# Altium project H7_PCB.PrjPcb (part 1 of 2)
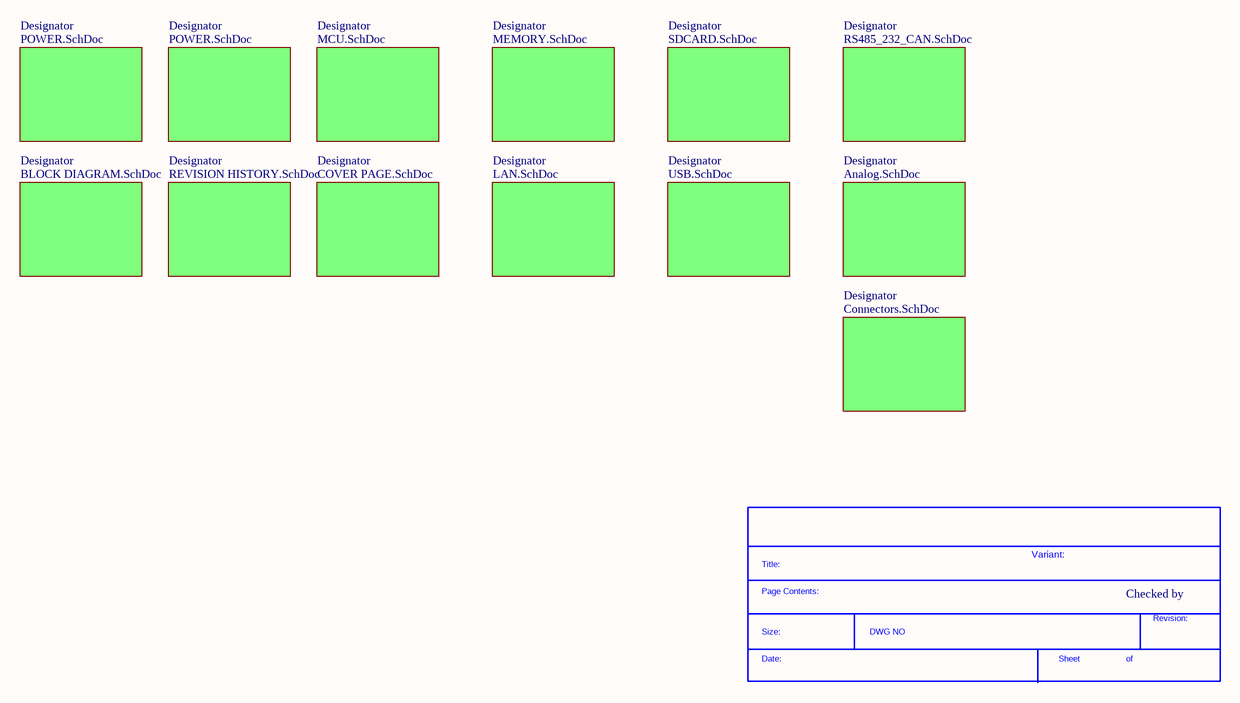
[diagram p0: PROJECT.SchDoc]
VersionRevision: V1I1; Project: H743; NotFitted: NF; MAINDESIGNER: Hamid Fijani; Company: ARKASSH; ClientWebsite: www.ArkaSSH.ir; ClientContactName: Hamid Fijani; ClientContactEmail: FijaniHamid@gmail.com; ClientCompanyName: ARKASSH
13 sheets, 297 parts. Net scope: flat (ports and power ports of the same name join across sheets).
Board file: PCB1.PcbDoc
Sheets:
  PROJECT.SchDoc
    Designator = MCU.SchDoc
    Designator = POWER.SchDoc
    Designator = POWER.SchDoc
    Designator = BLOCK DIAGRAM.SchDoc
    Designator = REVISION HISTORY.SchDoc
    Designator = MEMORY.SchDoc
    Designator = COVER PAGE.SchDoc
    Designator = LAN.SchDoc
    Designator = SDCARD.SchDoc
    Designator = USB.SchDoc
    Designator = RS485_232_CAN.SchDoc
    Designator = Analog.SchDoc
    Designator = Connectors.SchDoc

## Sheet PROJECT.SchDoc
size A4; SheetNumber: 1; SheetTotal: 13

### Parts
(Parts that share a designator on the sheet are numbered #1, #2 ... from top to bottom, then left to right.)
*?#1  SDTitleBlock  (value not drawn)  (graphical)

### Sub-sheets
Designator = MCU.SchDoc: no entries
Designator = POWER.SchDoc: no entries
Designator = POWER.SchDoc: no entries
Designator = BLOCK DIAGRAM.SchDoc: no entries
Designator = REVISION HISTORY.SchDoc: no entries
Designator = MEMORY.SchDoc: no entries
Designator = COVER PAGE.SchDoc: no entries
Designator = LAN.SchDoc: no entries
Designator = SDCARD.SchDoc: no entries
Designator = USB.SchDoc: no entries
Designator = RS485_232_CAN.SchDoc: no entries
Designator = Analog.SchDoc: no entries
Designator = Connectors.SchDoc: no entries

### Notes on the sheet
- Variant:
- Checked by
- (in symbol SDTitleBlock) Title:; Page Contents:; Revision:; Size:; DWG NO; Date:; Sheet; of

## Sheet MCU.SchDoc
size A3; SheetNumber: 4; SheetTotal: 13
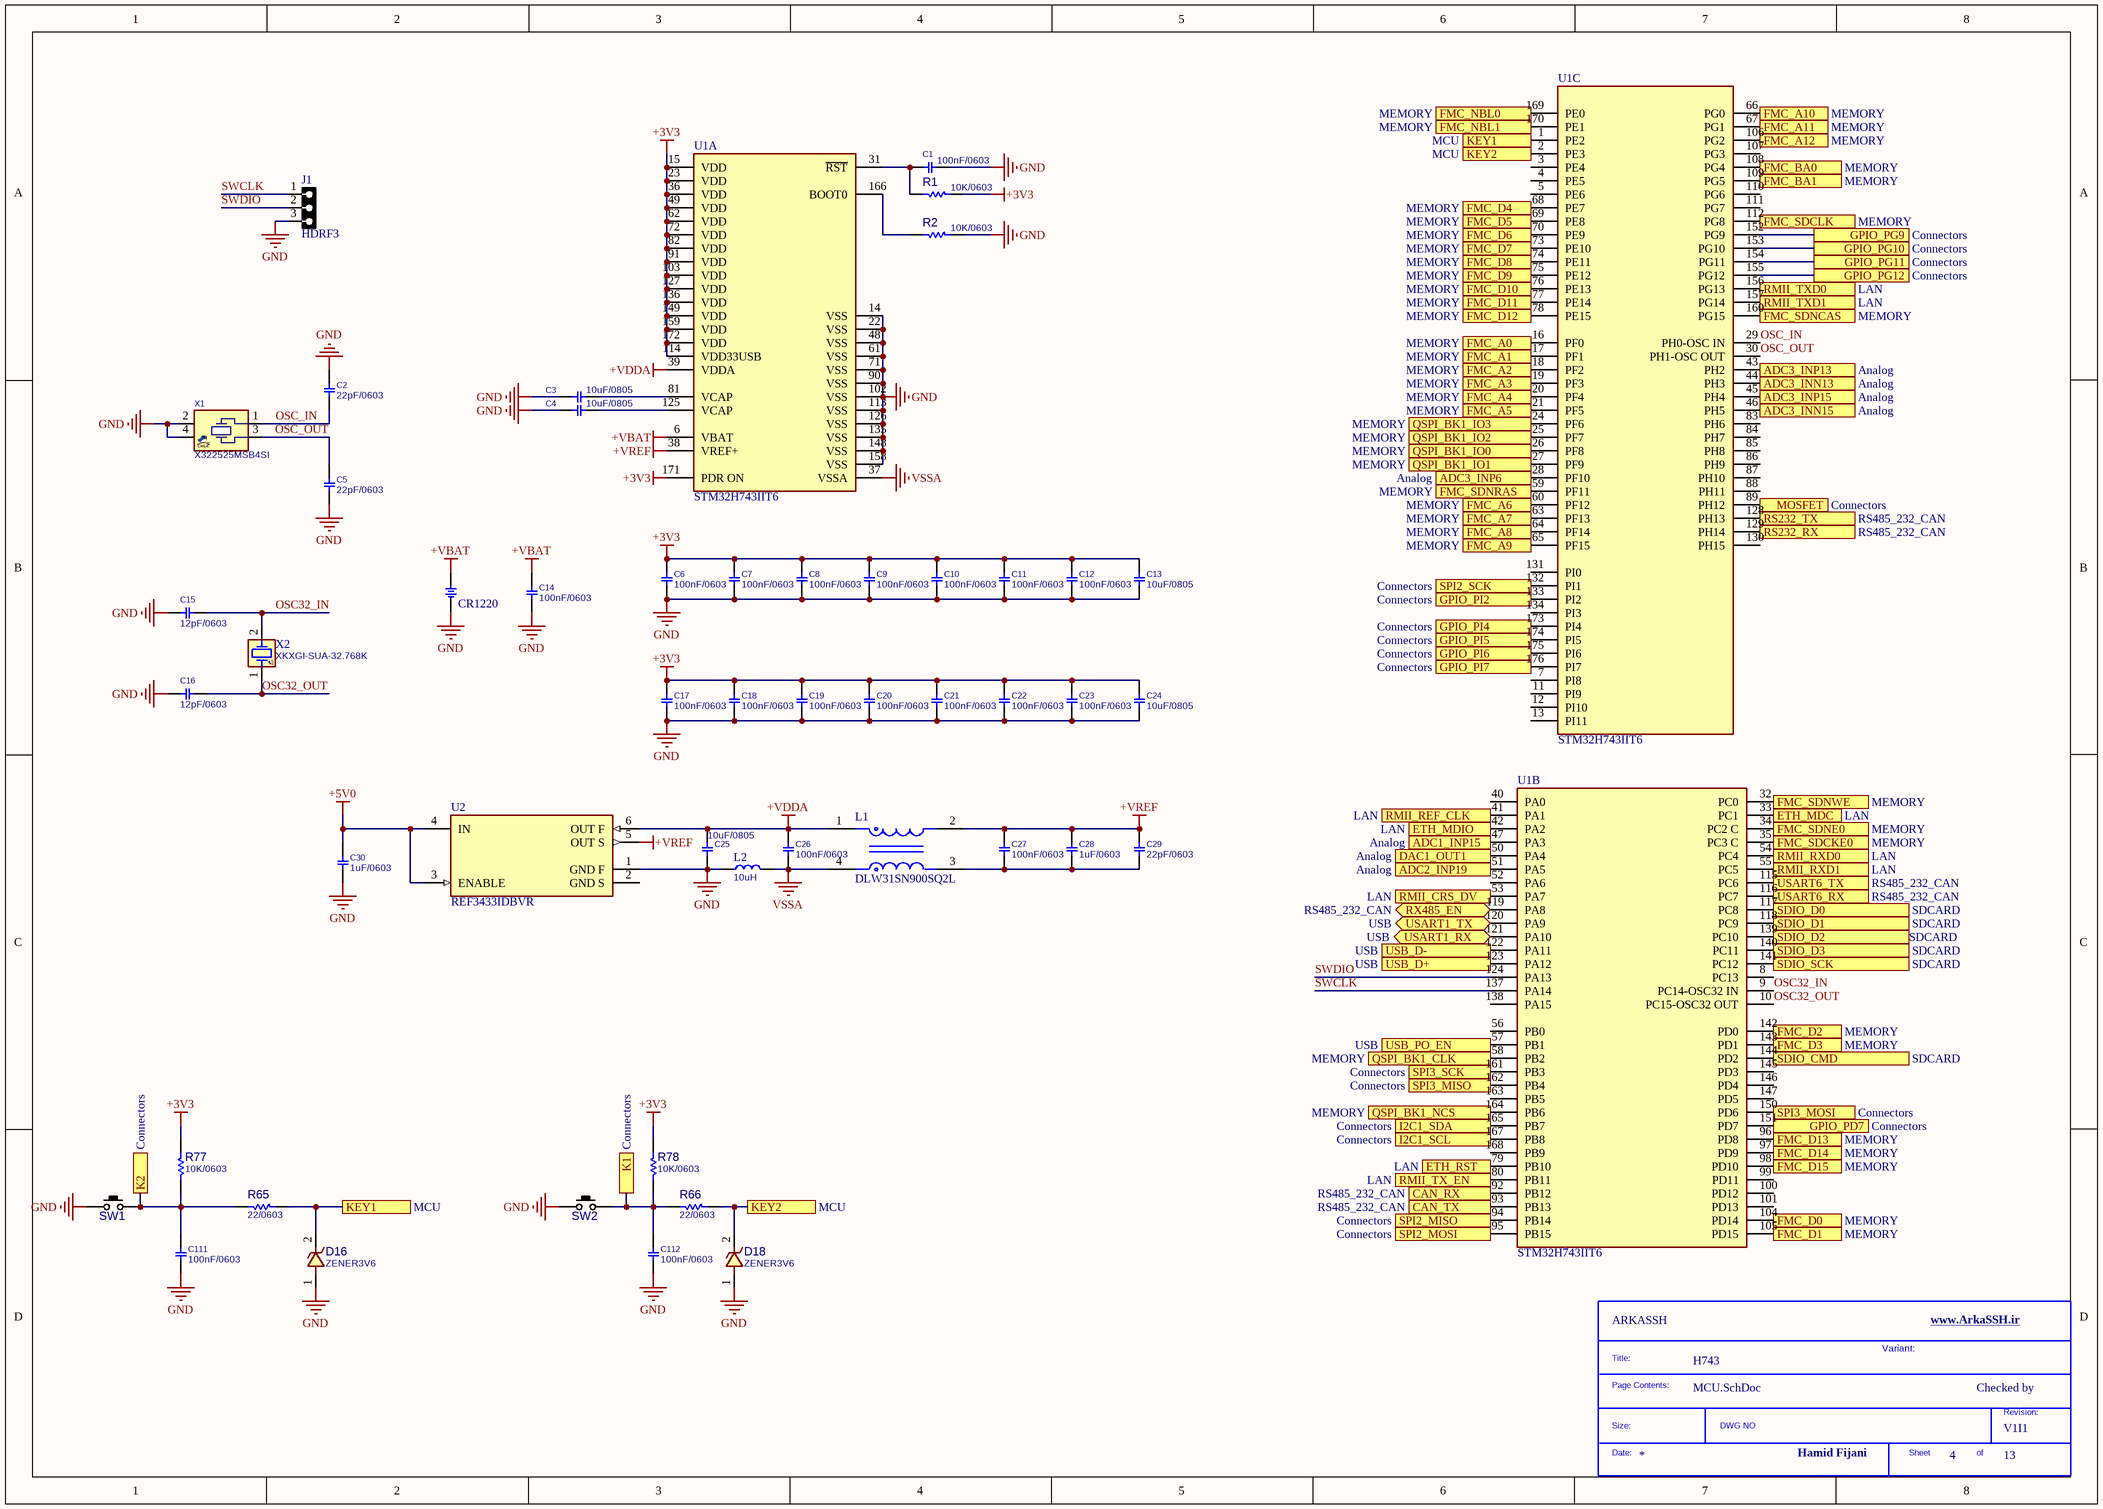
[diagram p1: MCU.SchDoc]

### Parts
(Parts that share a designator on the sheet are numbered #1, #2 ... from top to bottom, then left to right.)
?#1  (no value)  (graphical)
BT1  CR1220  [BTH1220]
C1  100nF/0603  [C0603]
C2  22pF/0603  [C0603]
C3  10uF/0805  [C0805]
C4  10uF/0805  [C0805]
C5  22pF/0603  [C0603]
C6  100nF/0603  [C0603]
C7  100nF/0603  [C0603]
C8  100nF/0603  [C0603]
C9  100nF/0603  [C0603]
C10  100nF/0603  [C0603]
C11  100nF/0603  [C0603]
C12  100nF/0603  [C0603]
C13  10uF/0805  [C0805]
C14  100nF/0603  [C0603]
C15  12pF/0603  [C0603]
C16  12pF/0603  [C0603]
C17  100nF/0603  [C0603]
C18  100nF/0603  [C0603]
C19  100nF/0603  [C0603]
C20  100nF/0603  [C0603]
C21  100nF/0603  [C0603]
C22  100nF/0603  [C0603]
C23  100nF/0603  [C0603]
C24  10uF/0805  [C0805]
C25  10uF/0805  [C0805]
C26  100nF/0603  [C0603]
C27  100nF/0603  [C0603]
C28  1uF/0603  [C0603]
C29  22pF/0603  [C0603]
C30  1uF/0603  [C0603]
C111  100nF/0603  [C0603]
C112  100nF/0603  [C0603]
D16  ZENER3V6  [D_SOD123W]
D18  ZENER3V6  [D_SOD123W]
J1  HDRF3  [HDR_F_1X3]
L1  DLW31SN900SQ2L  [FP-DLW31S-MFG]
L2  10uH  [L0805]
R1  10K/0603  [R0603]
R2  10K/0603  [R0603]
R65  22/0603  [R0603]
R66  22/0603  [R0603]
R77  10K/0603  [R0603]
R78  10K/0603  [R0603]
SW1  PUSHBUTTON  [SWPBS_SPST_6X3X5]  (value not drawn)
SW2  PUSHBUTTON  [SWPBS_SPST_6X3X5]  (value not drawn)
U1  STM32H743IIT6  [FP-LQFP176-1T-IPC_C]  (parts A,B,C of 3)
U2  REF3433IDBVR  [FP-DBV0006A-MFG]
X1  X322525MSB4SI  [XTL_4_3225]
X2  XKXGI-SUA-32.768K  [XTL_2_3215]

### Ports
ADC1_INP15 (see Analog), ADC2_INP19 (see Analog), ADC3_INN13 (see Analog), ADC3_INN15 (see Analog), ADC3_INP6 (see Analog), ADC3_INP13 (see Analog), ADC3_INP15 (see Analog), CAN_RX (see RS485_232_CAN), CAN_TX (see RS485_232_CAN), DAC1_OUT1 (see Analog), ETH_MDC (see LAN), ETH_MDIO (see LAN), ETH_RST (see LAN), FMC_A0 (see MEMORY), FMC_A1 (see MEMORY), FMC_A2 (see MEMORY), FMC_A3 (see MEMORY), FMC_A4 (see MEMORY), FMC_A5 (see MEMORY), FMC_A6 (see MEMORY), FMC_A7 (see MEMORY), FMC_A8 (see MEMORY), FMC_A9 (see MEMORY), FMC_A10 (see MEMORY), FMC_A11 (see MEMORY), FMC_A12 (see MEMORY), FMC_BA0 (see MEMORY), FMC_BA1 (see MEMORY), FMC_D0 (see MEMORY), FMC_D1 (see MEMORY), FMC_D2 (see MEMORY), FMC_D3 (see MEMORY), FMC_D4 (see MEMORY), FMC_D5 (see MEMORY), FMC_D6 (see MEMORY), FMC_D7 (see MEMORY), FMC_D8 (see MEMORY), FMC_D9 (see MEMORY), FMC_D10 (see MEMORY), FMC_D11 (see MEMORY), FMC_D12 (see MEMORY), FMC_D13 (see MEMORY), FMC_D14 (see MEMORY), FMC_D15 (see MEMORY), FMC_NBL0 (see MEMORY), FMC_NBL1 (see MEMORY), FMC_SDCKE0 (see MEMORY), FMC_SDCLK (see MEMORY), FMC_SDNCAS (see MEMORY), FMC_SDNE0 (see MEMORY), FMC_SDNRAS (see MEMORY), FMC_SDNWE (see MEMORY), GPIO_PD7 (see Connectors), GPIO_PG9 (see Connectors), GPIO_PG10 (see Connectors), GPIO_PG11 (see Connectors), GPIO_PG12 (see Connectors), GPIO_PI2 (see Connectors), GPIO_PI4 (see Connectors), GPIO_PI5 (see Connectors), GPIO_PI6 (see Connectors), GPIO_PI7 (see Connectors), I2C1_SCL (see Connectors), I2C1_SDA (see Connectors), K1 (see Connectors), K2 (see Connectors), KEY1 (see MCU), KEY2 (see MCU), MOSFET (see Connectors), QSPI_BK1_CLK (see MEMORY), QSPI_BK1_IO0 (see MEMORY), QSPI_BK1_IO1 (see MEMORY), QSPI_BK1_IO2 (see MEMORY), QSPI_BK1_IO3 (see MEMORY), QSPI_BK1_NCS (see MEMORY), RMII_CRS_DV (see LAN), RMII_REF_CLK (see LAN), RMII_RXD0 (see LAN), RMII_RXD1 (see LAN), RMII_TX_EN (see LAN), RMII_TXD0 (see LAN), RMII_TXD1 (see LAN), RS232_RX (see RS485_232_CAN), RS232_TX (see RS485_232_CAN), RX485_EN (bidir, see RS485_232_CAN), SDIO_CMD (see SDCARD), SDIO_D0 (see SDCARD), SDIO_D1 (see SDCARD), SDIO_D2 (see SDCARD), SDIO_D3 (see SDCARD), SDIO_SCK (see SDCARD), SPI2_MISO (see Connectors), SPI2_MOSI (see Connectors), SPI2_SCK (see Connectors), SPI3_MISO (see Connectors), SPI3_MOSI (see Connectors), SPI3_SCK (see Connectors), USART1_RX (bidir, see USB), USART1_TX (bidir, see USB), USART6_RX (see RS485_232_CAN), USART6_TX (see RS485_232_CAN), USB_D+ (see USB), USB_D- (see USB), USB_PO_EN (see USB)

### Nets
+3V3: C6.2 C7.2 C8.2 C9.2 C10.2 C11.2 C12.2 C13.2 C17.2 C18.2 C19.2 C20.2 C21.2 C22.2 C23.2 C24.2 R1.2 R77.2 R78.2 U1.15(VDD) U1.23(VDD) U1.36(VDD) U1.49(VDD) U1.62(VDD) U1.72(VDD) U1.82(VDD) U1.91(VDD) U1.103(VDD) U1.114(VDD33USB) U1.127(VDD) U1.136(VDD) U1.149(VDD) U1.159(VDD) U1.171(PDR_ON) U1.172(VDD)
+5V0: C30.2 U2.3(ENABLE) U2.4(IN)
+VBAT: BT1.1 C14.2 U1.6(VBAT)
+VDDA: C25.2 C26.2 L1.1 U1.39(VDDA) U2.6(OUT_F)
+VREF: C27.2 C28.2 C29.2 L1.2 U1.38(VREF+) U2.5(OUT_S)
GND: BT1.2 C1.1 C2.2 C3.1 C4.1 C5.1 C6.1 C7.1 C8.1 C9.1 C10.1 C11.1 C12.1 C13.1 C14.1 C15.2 C16.2 C17.1 C18.1 C19.1 C20.1 C21.1 C22.1 C23.1 C24.1 C25.1 C30.1 C111.1 C112.1 D16.1 D18.1 J1.3 L2.1 R2.2 SW1.1(P1) SW2.1(P1) U1.14(VSS) U1.22(VSS) U1.48(VSS) U1.61(VSS) U1.71(VSS) U1.90(VSS) U1.102(VSS) U1.113(VSS) U1.126(VSS) U1.135(VSS) U1.148(VSS) U1.158(VSS) U2.1(GND_F) X1.2 X1.4
VSSA: C26.1 L1.4 L2.2 U1.37(VSSA)
DUSB1_N: U1.122(PA11) ; port USB_D-
DUSB1_P: U1.123(PA12) ; port USB_D+
OSC32_IN: C15.1 U1.9(PC14-OSC32_IN) X2.2(OSC2)
OSC32_OUT: C16.1 U1.10(PC15-OSC32_OUT) X2.1(OSC1)
OSC_IN: C2.1 U1.29(PH0-OSC_IN) X1.1
OSC_OUT: C5.2 U1.30(PH1-OSC_OUT) X1.3
RMII_CRS_DV: U1.53(PA7) ; port RMII_CRS_DV
RMII_REF_CLK: U1.41(PA1) ; port RMII_REF_CLK
RMII_RXD0: U1.54(PC4) ; port RMII_RXD0
RMII_RXD1: U1.55(PC5) ; port RMII_RXD1
RMII_TX_EN: U1.80(PB11) ; port RMII_TX_EN
RMII_TXD0: U1.156(PG13) ; port RMII_TXD0
RMII_TXD1: U1.157(PG14) ; port RMII_TXD1
SD_CMD: U1.144(PD2) ; port SDIO_CMD
SD_D0: U1.117(PC8) ; port SDIO_D0
SD_D1: U1.118(PC9) ; port SDIO_D1
SD_D2: U1.139(PC10) ; port SDIO_D2
SD_D3: U1.140(PC11) ; port SDIO_D3
SD_SCK: U1.141(PC12) ; port SDIO_SCK
SWCLK: J1.1 U1.137(PA14)
SWDIO: J1.2 U1.124(PA13)
NetC1_2: C1.2 R1.1 U1.31(~{RST})
NetC3_2: C3.2 U1.81(VCAP)
NetC4_2: C4.2 U1.125(VCAP)
NetC27_1: C27.1 C28.1 C29.1 L1.3
NetC73_1: U1.43(PH2) ; port ADC3_INP13
NetC75_2: U1.44(PH3) ; port ADC3_INN13
NetC77_1: U1.47(PA3) ; port ADC1_INP15
NetC86_1: U1.51(PA5) ; port ADC2_INP19
NetC94_1: U1.45(PH4) ; port ADC3_INP15
NetC98_2: U1.46(PH5) ; port ADC3_INN15
NetC111_2: C111.2 R65.2 R77.1 SW1.2(P3) ; port K2
NetC112_2: C112.2 R66.2 R78.1 SW2.2(P3) ; port K1
NetD16_2: D16.2 R65.1 U1.1(PE2) ; port KEY1
NetD18_2: D18.2 R66.1 U1.2(PE3) ; port KEY2
NetJ9_1: U1.153(PG10) ; port GPIO_PG10
NetJ9_2: U1.151(PD7) ; port GPIO_PD7
NetJ9_3: U1.154(PG11) ; port GPIO_PG11
NetJ9_4: U1.152(PG9) ; port GPIO_PG9
NetJ9_5: U1.155(PG12) ; port GPIO_PG12
NetJ9_7: U1.150(PD6) ; port SPI3_MOSI
NetJ9_9: U1.161(PB3) ; port SPI3_SCK
NetJ9_11: U1.162(PB4) ; port SPI3_MISO
NetJ9_13: U1.173(PI4) ; port GPIO_PI4
NetJ9_15: U1.174(PI5) ; port GPIO_PI5
NetJ9_17: U1.175(PI6) ; port GPIO_PI6
NetJ9_19: U1.176(PI7) ; port GPIO_PI7
NetR2_1: R2.1 U1.166(BOOT0)
NetR8_2: U1.79(PB10) ; port ETH_RST
NetR9_1: U1.42(PA2) ; port ETH_MDIO
NetR27_2: U1.34(PC2_C) ; port FMC_SDNE0
NetR29_1: U1.57(PB1) ; port USB_PO_EN
NetR31_2: U1.121(PA10) ; port USART1_RX
NetR32_2: U1.120(PA9) ; port USART1_TX
NetR34_2: U1.116(PC7) ; port USART6_RX
NetR36_2: U1.119(PA8) ; port RX485_EN
NetR57_1: U1.50(PA4) ; port DAC1_OUT1
NetR69_2: U1.28(PF10) ; port ADC3_INP6
NetR75_2: U1.89(PH12) ; port MOSFET
NetR82_2: U1.167(PB8) ; port I2C1_SCL
NetR83_2: U1.165(PB7) ; port I2C1_SDA
NetR86_1: U1.133(PI2) ; port GPIO_PI2
NetR87_1: U1.94(PB14) ; port SPI2_MISO
NetR88_1: U1.95(PB15) ; port SPI2_MOSI
NetR89_1: U1.132(PI1) ; port SPI2_SCK
NetU1_16: U1.16(PF0) ; port FMC_A0
NetU1_17: U1.17(PF1) ; port FMC_A1
NetU1_18: U1.18(PF2) ; port FMC_A2
NetU1_19: U1.19(PF3) ; port FMC_A3
NetU1_20: U1.20(PF4) ; port FMC_A4
NetU1_21: U1.21(PF5) ; port FMC_A5
NetU1_24: U1.24(PF6) ; port QSPI_BK1_IO3
NetU1_25: U1.25(PF7) ; port QSPI_BK1_IO2
NetU1_26: U1.26(PF8) ; port QSPI_BK1_IO0
NetU1_27: U1.27(PF9) ; port QSPI_BK1_IO1
NetU1_32: U1.32(PC0) ; port FMC_SDNWE
NetU1_33: U1.33(PC1) ; port ETH_MDC
NetU1_35: U1.35(PC3_C) ; port FMC_SDCKE0
NetU1_58: U1.58(PB2) ; port QSPI_BK1_CLK
NetU1_59: U1.59(PF11) ; port FMC_SDNRAS
NetU1_60: U1.60(PF12) ; port FMC_A6
NetU1_63: U1.63(PF13) ; port FMC_A7
NetU1_64: U1.64(PF14) ; port FMC_A8
NetU1_65: U1.65(PF15) ; port FMC_A9
NetU1_66: U1.66(PG0) ; port FMC_A10
NetU1_67: U1.67(PG1) ; port FMC_A11
NetU1_68: U1.68(PE7) ; port FMC_D4
NetU1_69: U1.69(PE8) ; port FMC_D5
NetU1_70: U1.70(PE9) ; port FMC_D6
NetU1_73: U1.73(PE10) ; port FMC_D7
NetU1_74: U1.74(PE11) ; port FMC_D8
NetU1_75: U1.75(PE12) ; port FMC_D9
NetU1_76: U1.76(PE13) ; port FMC_D10
NetU1_77: U1.77(PE14) ; port FMC_D11
NetU1_78: U1.78(PE15) ; port FMC_D12
NetU1_92: U1.92(PB12) ; port CAN_RX
NetU1_93: U1.93(PB13) ; port CAN_TX
NetU1_96: U1.96(PD8) ; port FMC_D13
NetU1_97: U1.97(PD9) ; port FMC_D14
NetU1_98: U1.98(PD10) ; port FMC_D15
NetU1_104: U1.104(PD14) ; port FMC_D0
NetU1_105: U1.105(PD15) ; port FMC_D1
NetU1_106: U1.106(PG2) ; port FMC_A12
NetU1_108: U1.108(PG4) ; port FMC_BA0
NetU1_109: U1.109(PG5) ; port FMC_BA1
NetU1_112: U1.112(PG8) ; port FMC_SDCLK
NetU1_115: U1.115(PC6) ; port USART6_TX
NetU1_128: U1.128(PH13) ; port RS232_TX
NetU1_129: U1.129(PH14) ; port RS232_RX
NetU1_142: U1.142(PD0) ; port FMC_D2
NetU1_143: U1.143(PD1) ; port FMC_D3
NetU1_160: U1.160(PG15) ; port FMC_SDNCAS
NetU1_164: U1.164(PB6) ; port QSPI_BK1_NCS
NetU1_169: U1.169(PE0) ; port FMC_NBL0
NetU1_170: U1.170(PE1) ; port FMC_NBL1

Not connected (* = marked no-connect by the designer): U1 3(PE4) 4(PE5) 5(PE6) 7(PI8) 8(PC13) 11(PI9) 12(PI10) 13(PI11) 40(PA0) 52(PA6) 56(PB0) 83(PH6) 84(PH7) 85(PH8) 86(PH9) 87(PH10) 88(PH11) 99(PD11) 100(PD12) 101(PD13) 107(PG3) 110(PG6) 111(PG7) 130(PH15) 131(PI0) 134(PI3) 138(PA15) 145(PD3) 146(PD4) 147(PD5) 163(PB5) 168(PB9); U2 2(GND_S)

### Notes on the sheet
- Title:
- Page Contents:
- Variant:
- Checked by
- Size:
- Date:
- DWG NO
- Sheet
- of
- Revision:

### Library data of the parts
?#1 = SDTitleBlock
BT1 = BATH_CR1220: BATTERY HOLDER, CR1220; MANF_P#: -; .: http://www.chila.ir; VALUE: CR1220
C1 C2 C5-C12 C14-C23 C26-C30 C111 C112 = CAP_SMD_MLCC_0603: CAP, MLCC; PARAM: -, -%; MANF_P#: MANF_PART#; PARAM2: -V; PRICE: 100= 1$; MANF: -; ASSEMBLY: ASSEMBLY
  C1 C6-C12 C14 C17-C23 C26 C27 C111 C112: VALUE: 100nF/0603
  C2 C5 C29: VALUE: 22pF/0603
  C15 C16: VALUE: 12pF/0603
  C28 C30: VALUE: 1uF/0603
C3 C4 C13 C24 C25 = CAP_SMD_MLCC: CAP, MLCC; PARAM: C0G, 10%; DESC: CAP, MLCC, 1nF, 50V, C0G, 10%, 0402; MANF_P#: MANF_PART#; MANF: Murata; PARAM2: 50V; PRICE: 100= 1$; ASSEMBLY: ASSEMBLY; VALUE: 10uF/0805
D16 D18 = DIODE_SMD_ZENER_DFLZ5V6: DIODE, ZENER, 1W, 5.1V; MANF: Diodes; DESC: DESCRIPTION; PARAM2: 1W, 4Ohm, -55~150oC; PARAM: 5.6V; MANF_P#: DFLZ5V6-7; ASSEMBLY: ASSEMBLY; PRICE: 0.5$; VALUE: ZENER3V6
J1 = HDR_F_1X3: CONN, HEADER, Female, pitch: 2.54mm, 3POS; VALUE: HDRF3
L1 = CMP-06045-000166-1: CMC 370MA 2LN 90 OHM SMD; Frequency: 100MHz; DC Resistance (DCR): 300mR; Tolerance: 25%; Shielding: Unshielded; Impedance: 90R; Voltage Rating: 50V; Number of Lines: 2; Weight: 0.001376oz; Case/Package: 1206; Width: 0.063inch; Case Code (Imperial): 1206; Max Operating Temperature: 85°C; Lead Free: Lead Free; Max DC Current: 370mA; DC Current: 370mA; Military Standard: Not; Package Quantity: 1; Radiation Hardening: No; Packaging: Tape and Reel; Depth: 1.6mm; Height: 1.9mm; Termination: SMD/SMT; Current: 370mA; Length: 3.2mm; Current Rating: 370mA; Resistor Type: Wirewound; Mount: Surface Mount; Min Operating Temperature: -40°C; Test Frequency: 100MHz
L2 = IND_SMD: INDUCTOR, SMD; VALUE: 10uH
R1 R2 R65 R66 R77 R78 = RES_SMD_0603: RESISTOR, SMD; PARAM: 1%, 0.1W; DESC: DESCRIPTION; DIST#: MOUSER; MANF_P#: -; MANF: -; ASSEMBLY: ASSEMBLY; PRICE: -; PARAM2: -
  R1 R2 R77 R78: VALUE: 10K/0603
  R65 R66: VALUE: 22/0603
SW1 SW2 = SWPBS_SPST_6X3X4: SWITCH, PUSH BUTTON, TACTILE, SMD, SPST, 6X3.5X4.3mm; MANF: Panasonic; DESC: DESCRIPTION; MANF_P#: EVQ-PNF04M; VALUE: PUSHBUTTON; ASSEMBLY: ASSEMBLY; PARAM: PARAM; PRICE: PRICE
U1 = CMP-12105-000078-1: IC MCU 32BIT 2MB FLASH 176LQFP; Manufacturer: STMicroelectronics; Number Of I/Os: 140; Number Of Pwm Channels: 2; Standoff Height: 0.05mm; Number Of Uart Channels: 9; Frequency: 400MHz; Core Architecture: ARM Cortex-M7; Ram Size: 1MBytes; Max Supply Voltage: 3.6V; Number Of Timers/Counters: 20; Min Supply Voltage: 1.62V; Number Of I2C Channels: 4; Number Of Cores: 1; Max Junction Temp: +125°C; Data Bus Width: 32bits; Memory Size: 2MBytes; Number Of Adc Channels: 36; Number Of Spi Channels: 6; Interface: I2C,SPI,UART,USART,CAN,USB,LIN,IrDA,Ethernet,SMBus,Other; Number Of A/D Converters: 3; Digikey Description: IC MCU 32BIT 2MB FLASH 176LQFP; Temperature: -40°C to +125°C; Package: LQFP176-1T; RoHS: TRUE; Memory Type: FLASH; Device Class L3: Microcontrollers; Manufacturer Part Number: STM32H743IIT6; Mouser Description: MCU 32-Bit STM32 ARM Cortex M7 RISC 2MB Flash 1.8V/2.5V/3.3V 176-Pin LQFP Tray; Category: IC; Automotive: No; Ambient Temperature Range High: +85°C; Number Of Usb Channels: 2; ComponentLink2URL: https://www.st.com/resource/en/datasheet/stm32h743ii.pdf; Lead Free: Yes; Ambient Temperature Range Low: -40°C; ComponentLink2Description: Datasheet; Device Class L2: Embedded Processors and Controllers; Octopart: https://octopart.com/stm32h743iit6-stmicroelectronics-76372526; Device Class L1: Integrated Circuits (ICs); Height: 1.6mm; Temperature Range Low: -40°C; Temperature Range High: +125°C; Number Of Ethernet Channels: 1; Ipc Land Pattern Name: QFP50P2600X2600X160-176
U2 = CMP-04916-000020-1: IC VREF SERIES 0.05% SOT23-6; Output Current: 10mA; Min Output Voltage: 3.3V; Operating Supply Current: 95uA; Output Type: Fixed; Temperature Coefficient: 6ppm/°C; Mount: Surface Mount; Tolerance: 0.05%; Packaging: Tape and Reel; Min Operating Temperature: -40°C; Max Operating Temperature: 125°C; Reference Type: Series; Case/Package: SOT-23-6
X1 = XTL_4_24MHz_3225A: Crystal 24MHz; MANF: ABRACON; MANF_P#: ABM8W-24.0000MHZ-4-D1X-T3; PARAM2: 10PPM, 4pF; PARAM: -40~85oC; PRICE: 0.7$; VALUE: X322525MSB4SI
X2 = XTL_2_32.768_3215C: Crystal, 32.768KHz, 5pF, 20PPM; MANF: CTS; MANF_P#: TFE322T32K7680R; PARAM: -40~85oC; PARAM2: 5pF, 20PPM; PRICE: 0.9$; VALUE: XKXGI-SUA-32.768K

## Sheet POWER.SchDoc
size A3; SheetNumber: 6; SheetTotal: 13
Used 2 times, as channels Designator, Designator. Parts and nets are listed once, with the designators drawn on the sheet.
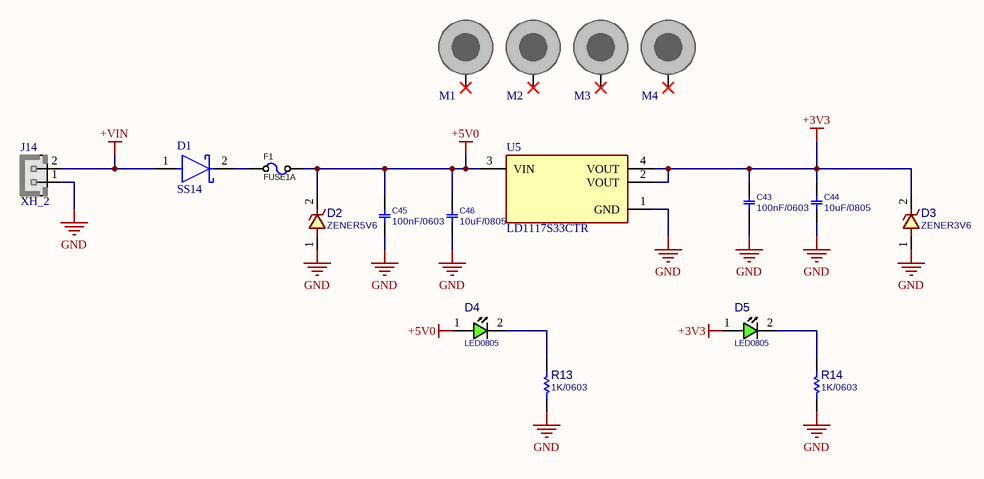
[diagram p2: POWER.SchDoc]

### Parts
?  (no value)  (graphical)
C43  100nF/0603  [C0603]
C44  10uF/0805  [C0805]
C45  100nF/0603  [C0603]
C46  10uF/0805  [C0805]
D1  SS14  [FP-403AE-MFG]
D2  ZENER5V6  [D_SOD123W]
D3  ZENER3V6  [D_SOD123W]
D4  LED0805  [LED0805]
D5  LED0805  [LED0805]
F1  FUSE1A  [F1206]
J14  XH_2  [XH_2]
M1  DNP/MH  [SCMH_M3FT]  (value not drawn)  (no BOM)
M2  DNP/MH  [SCMH_M3FT]  (value not drawn)  (no BOM)
M3  DNP/MH  [SCMH_M3FT]  (value not drawn)  (no BOM)
M4  DNP/MH  [SCMH_M3FT]  (value not drawn)  (no BOM)
R13  1K/0603  [R0603]
R14  1K/0603  [R0603]
U5  LD1117S33CTR  [FP-SOT-223-0046067_14-MFG]

### Nets
+3V3: C43.2 C44.2 D3.2 D5.1(ANODE) U5.2(VOUT) U5.4(VOUT)
+5V0: C45.2 C46.2 D2.2 D4.1(ANODE) F1.2 U5.3(VIN)
+VIN: D1.1(A) J14.2
GND: C43.1 C44.1 C45.1 C46.1 D2.1 D3.1 J14.1 R13.1 R14.1 U5.1(GND)
NetD1_2: D1.2(C) F1.1
NetD4_2: D4.2(CATHODE) R13.2
NetD5_2: D5.2(CATHODE) R14.2

Not connected (* = marked no-connect by the designer): M1 1*; M2 1*; M3 1*; M4 1*

### Channels
Designator: designators end in _Designator#1
Designator: designators end in _Designator#2

### Notes on the sheet
- Title:
- Page Contents:
- Variant:
- Checked by
- Size:
- Date:
- DWG NO
- Sheet
- of
- Revision:

### Library data of the parts
? = SDTitleBlock
C43 C45 = CAP_SMD_MLCC_0603: as C1 on sheet MCU; PRICE: 100= 1$; MANF: -; ASSEMBLY: ASSEMBLY; VALUE: 100nF/0603
C44 C46 = CAP_SMD_MLCC: as C3 on sheet MCU; PRICE: 100= 1$; ASSEMBLY: ASSEMBLY; VALUE: 10uF/0805
D1 = CMP-2000-04943-2: DIODE SCHOTTKY 40V 1A SMA; Manufacturer: ON Semiconductor; Peak Reverse Current: 0.2mA; Max Junction Temp: +125°C; Standoff Height: 0.05mm; Max Surge Forward Current: 40A; Mouser Description: Schottky Diodes & Rectifiers SMA 40V 1.0A; RoHS: TRUE; Lead Free: Yes; Manufacturer Part Number: SS14; Device Class L3: Schottky Diodes; Category: Diode; Automotive: No; Digikey Description: DIODE SCHOTTKY 40V 1A SMA; ComponentLink2Description: Datasheet; Device Class L2: Diodes; Height: 2.5mm; Temperature Range High: +125°C; ComponentLink2URL: https://www.onsemi.com/pub/Collateral/SS19-D.PDF; Device Class L1: Discrete Semiconductors; Package: 403AE; Octopart: https://octopart.com/ss14-on+semiconductor-29205033; Max Repetitive Reverse Voltage: 40V; Temperature Range Low: -65°C; Forward Current: 1A; Temperature: -65°C to +125°C
D2 D3 = DIODE_SMD_ZENER_DFLZ5V6: as D16 on sheet MCU; ASSEMBLY: ASSEMBLY; PRICE: 0.5$
  D2: VALUE: ZENER5V6
  D3: VALUE: ZENER3V6
D4 D5 = LED_SMD_0805: LED, SMD, 0805; DESC: DESCRIPTION; MANF_P#: MANF_PART#; PARAM2: 2.2V; MANF: MANF; ASSEMBLY: ASSEMBLY; PRICE: PRICE; VALUE: LED0805
F1 = FUSE_160mA_1206: Fuse, 160mA, 63VDC, 1206, SMD, Fast Acting; PARAM: 160mA; 63VDC; slow-blow; MANF: Holly Fuse; MANF_P#: 12T-0160L; PARAM2: PARAM2; VALUE: FUSE1A
J14 = XH_2: PW10-x-M, JST-BxB-XH-A pitch: 2.5mm, 3A/250v; MANF: JST; MANF_P#: B2B-XH-A; PARAM2: 250v; PARAM: 3.0A; VALUE: XH_2
M1-M4 = SCMH_M3FT: SCREW mouting, M3, 3.0mm diameter and 6.0mm, FlatHead; ASSEMBLY: DNP; VALUE: DNP/MH
R13 R14 = RES_SMD_0603: as R1 on sheet MCU; MANF_P#: -; MANF: -; ASSEMBLY: ASSEMBLY; PRICE: -; PARAM2: -; VALUE: 1K/0603
U5 = CMP-0244-00307-2: IC REG LINEAR 3.3V 800MA SOT223; Input Bias Current: 5mA; Output Voltage Accuracy: 1%; Dropout Voltage: 1.1V; Power Dissipation: 12W; Polarity: Positive; Min Input Voltage: 5.3V; Quiescent Current: 10mA; Max Output Current: 1.3A; Output Current: 950mA; Number of Regulators: 1; Max Supply Voltage: 15V; Output Type: Fixed; Output Voltage: 3.3V; Number of Terminals: 4; Min Supply Voltage: 3.3V; Termination: SMD/SMT; Mount: Surface Mount; Max Power Dissipation: 12W; Case/Package: SOT-223; Lead Free: Lead Free; Height: 1.8mm; REACH SVHC: No SVHC; Radiation Hardening: No; Width: 3.5mm; Length: 6.5mm; Packaging: Tape and Reel; Max Input Voltage: 15V; Accuracy: 1%; Weight: 0.01lb; Contact Plating: Tin; Max Operating Temperature: 125°C; Number of Pins: 4; Max Output Voltage: 3.3V; Min Operating Temperature: -40°C; Nominal Output Voltage: 3.3V; Package Quantity: 1; Min Output Voltage: 3.3V; Number of Outputs: 1

## Sheet BLOCK DIAGRAM.SchDoc
size A; SheetNumber: 3; SheetTotal: 13
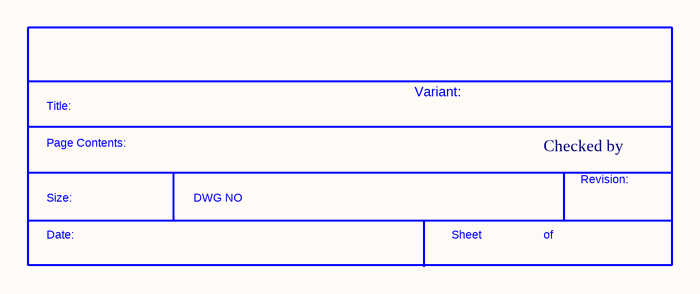
[diagram p3: BLOCK DIAGRAM.SchDoc]

### Parts
(Parts that share a designator on the sheet are numbered #1, #2 ... from top to bottom, then left to right.)
*?#2  SDTitleBlock  (value not drawn)  (graphical)

### Notes on the sheet
- Variant:
- Checked by
- (in symbol SDTitleBlock) Title:; Page Contents:; Revision:; Size:; DWG NO; Date:; Sheet; of

## Sheet REVISION HISTORY.SchDoc
size A3; SheetNumber: 13; SheetTotal: 13
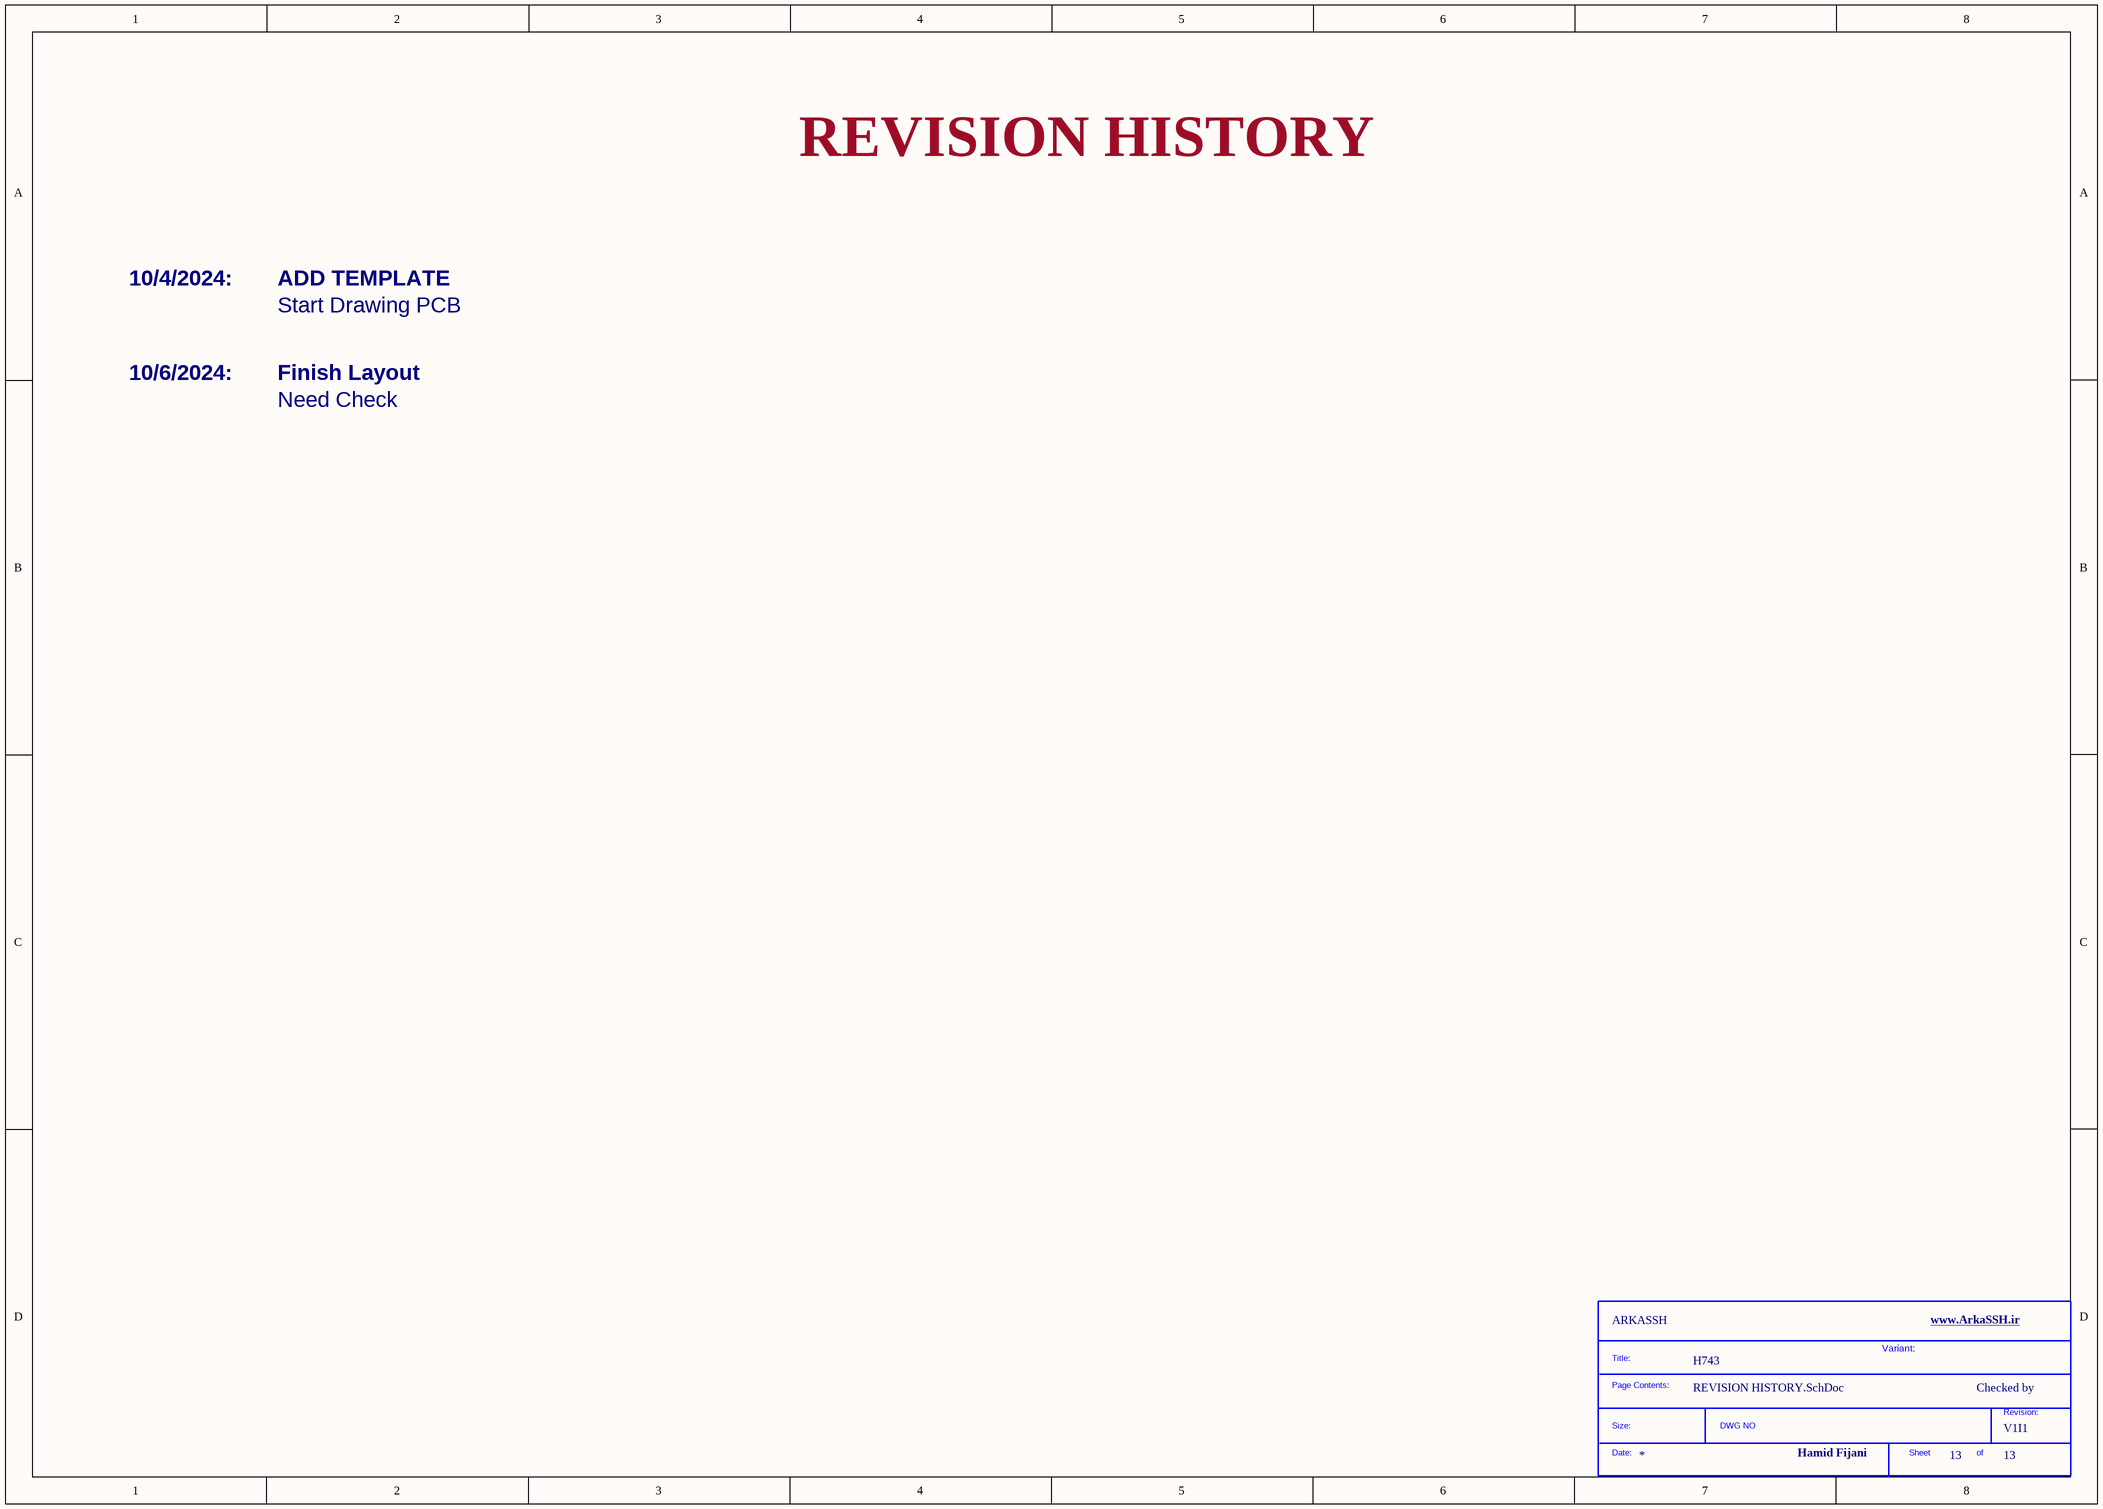
[diagram p4: REVISION HISTORY.SchDoc]

### Parts
(Parts that share a designator on the sheet are numbered #1, #2 ... from top to bottom, then left to right.)
*?#3  SDTitleBlock  (value not drawn)  (graphical)

### Notes on the sheet
- REVISION HISTORY
- 10/4/2024:
- ADD TEMPLATE
- Start Drawing PCB
- 10/6/2024:
- Finish Layout
- Need Check
- Variant:
- Checked by
- (in symbol SDTitleBlock) Title:; Page Contents:; Revision:; Size:; DWG NO; Date:; Sheet; of

## Sheet MEMORY.SchDoc
size A3; Author: HamidFijani; DrawnBy: HamidFijani; SheetNumber: 8; SheetTotal: 13
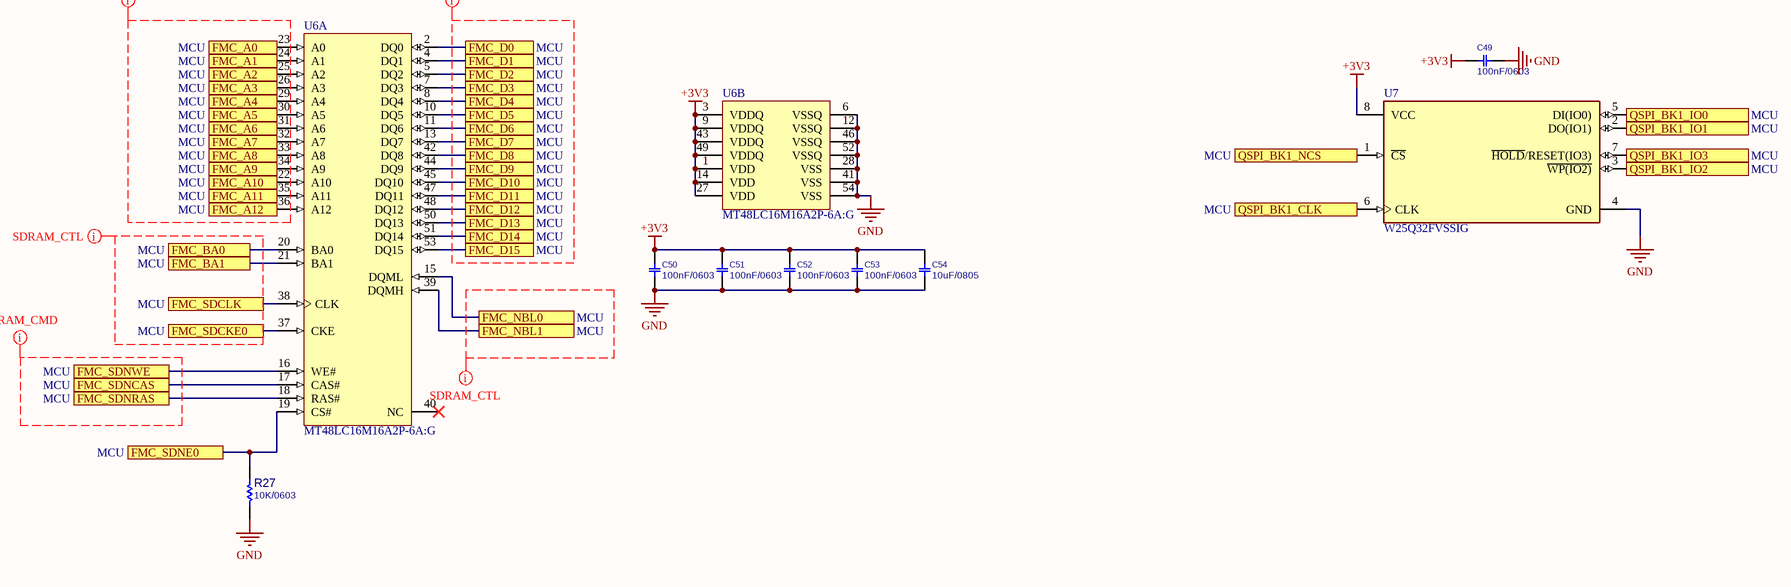
[diagram p5: MEMORY.SchDoc]

### Parts
(Parts that share a designator on the sheet are numbered #1, #2 ... from top to bottom, then left to right.)
?#2  (no value)  (graphical)
C49  100nF/0603  [C0603]
C50  100nF/0603  [C0603]
C51  100nF/0603  [C0603]
C52  100nF/0603  [C0603]
C53  100nF/0603  [C0603]
C54  10uF/0805  [C0805]
R27  10K/0603  [R0603]
U6  MT48LC16M16A2P-6A:G  [MICT-TG-54_N]  (parts A,B of 2)
U7  W25Q32FVSSIG  [FP-SS-MFG]

### Ports
FMC_A0 (see MCU), FMC_A1 (see MCU), FMC_A2 (see MCU), FMC_A3 (see MCU), FMC_A4 (see MCU), FMC_A5 (see MCU), FMC_A6 (see MCU), FMC_A7 (see MCU), FMC_A8 (see MCU), FMC_A9 (see MCU), FMC_A10 (see MCU), FMC_A11 (see MCU), FMC_A12 (see MCU), FMC_BA0 (see MCU), FMC_BA1 (see MCU), FMC_D0 (see MCU), FMC_D1 (see MCU), FMC_D2 (see MCU), FMC_D3 (see MCU), FMC_D4 (see MCU), FMC_D5 (see MCU), FMC_D6 (see MCU), FMC_D7 (see MCU), FMC_D8 (see MCU), FMC_D9 (see MCU), FMC_D10 (see MCU), FMC_D11 (see MCU), FMC_D12 (see MCU), FMC_D13 (see MCU), FMC_D14 (see MCU), FMC_D15 (see MCU), FMC_NBL0 (see MCU), FMC_NBL1 (see MCU), FMC_SDCKE0 (see MCU), FMC_SDCLK (see MCU), FMC_SDNCAS (see MCU), FMC_SDNE0 (see MCU), FMC_SDNRAS (see MCU), FMC_SDNWE (see MCU), QSPI_BK1_CLK (see MCU), QSPI_BK1_IO0 (see MCU), QSPI_BK1_IO1 (see MCU), QSPI_BK1_IO2 (see MCU), QSPI_BK1_IO3 (see MCU), QSPI_BK1_NCS (see MCU)

### Nets
+3V3: C49.2 C50.2 C51.2 C52.2 C53.2 C54.2 U6.1(VDD) U6.3(VDDQ) U6.9(VDDQ) U6.14(VDD) U6.27(VDD) U6.43(VDDQ) U6.49(VDDQ) U7.8(VCC)
GND: C49.1 C50.1 C51.1 C52.1 C53.1 C54.1 R27.1 U6.6(VSSQ) U6.12(VSSQ) U6.28(VSS) U6.41(VSS) U6.46(VSSQ) U6.52(VSSQ) U6.54(VSS) U7.4(GND)
NetR27_2: R27.2 U6.19(CS#) ; port FMC_SDNE0
NetU1_16: U6.23(A0) ; port FMC_A0
NetU1_17: U6.24(A1) ; port FMC_A1
NetU1_18: U6.25(A2) ; port FMC_A2
NetU1_19: U6.26(A3) ; port FMC_A3
NetU1_20: U6.29(A4) ; port FMC_A4
NetU1_21: U6.30(A5) ; port FMC_A5
NetU1_24: U7.7(~{HOLD}/RESET(IO3)) ; port QSPI_BK1_IO3
NetU1_25: U7.3(~{WP(IO2)}) ; port QSPI_BK1_IO2
NetU1_26: U7.5(DI(IO0)) ; port QSPI_BK1_IO0
NetU1_27: U7.2(DO(IO1)) ; port QSPI_BK1_IO1
NetU1_32: U6.16(WE#) ; port FMC_SDNWE
NetU1_35: U6.37(CKE) ; port FMC_SDCKE0
NetU1_58: U7.6(CLK) ; port QSPI_BK1_CLK
NetU1_59: U6.18(RAS#) ; port FMC_SDNRAS
NetU1_60: U6.31(A6) ; port FMC_A6
NetU1_63: U6.32(A7) ; port FMC_A7
NetU1_64: U6.33(A8) ; port FMC_A8
NetU1_65: U6.34(A9) ; port FMC_A9
NetU1_66: U6.22(A10) ; port FMC_A10
NetU1_67: U6.35(A11) ; port FMC_A11
NetU1_68: U6.8(DQ4) ; port FMC_D4
NetU1_69: U6.10(DQ5) ; port FMC_D5
NetU1_70: U6.11(DQ6) ; port FMC_D6
NetU1_73: U6.13(DQ7) ; port FMC_D7
NetU1_74: U6.42(DQ8) ; port FMC_D8
NetU1_75: U6.44(DQ9) ; port FMC_D9
NetU1_76: U6.45(DQ10) ; port FMC_D10
NetU1_77: U6.47(DQ11) ; port FMC_D11
NetU1_78: U6.48(DQ12) ; port FMC_D12
NetU1_96: U6.50(DQ13) ; port FMC_D13
NetU1_97: U6.51(DQ14) ; port FMC_D14
NetU1_98: U6.53(DQ15) ; port FMC_D15
NetU1_104: U6.2(DQ0) ; port FMC_D0
NetU1_105: U6.4(DQ1) ; port FMC_D1
NetU1_106: U6.36(A12) ; port FMC_A12
NetU1_108: U6.20(BA0) ; port FMC_BA0
NetU1_109: U6.21(BA1) ; port FMC_BA1
NetU1_112: U6.38(CLK) ; port FMC_SDCLK
NetU1_142: U6.5(DQ2) ; port FMC_D2
NetU1_143: U6.7(DQ3) ; port FMC_D3
NetU1_160: U6.17(CAS#) ; port FMC_SDNCAS
NetU1_164: U7.1(~{CS}) ; port QSPI_BK1_NCS
NetU1_169: U6.15(DQML) ; port FMC_NBL0
NetU1_170: U6.39(DQMH) ; port FMC_NBL1

Not connected (* = marked no-connect by the designer): U6 40(NC)*

### Layout directives
net class SDRAM_ADD: (no net found under the mark)
net class SDRAM_DATA: (no net found under the mark)
net class SDRAM_CMD: (no net found under the mark)
net class SDRAM_CTL: (no net found under the mark)

### Notes on the sheet
- Title:
- Page Contents:
- Variant:
- Checked by
- Size:
- Date:
- DWG NO
- Sheet
- of
- Revision:

### Library data of the parts
?#2 = SDTitleBlock
C49-C53 = CAP_SMD_MLCC_0603: as C1 on sheet MCU; PRICE: 100= 1$; MANF: -; ASSEMBLY: ASSEMBLY; VALUE: 100nF/0603
C54 = CAP_SMD_MLCC: as C3 on sheet MCU; PRICE: 100= 1$; ASSEMBLY: ASSEMBLY; VALUE: 10uF/0805
R27 = RES_SMD_0603: as R1 on sheet MCU; MANF_P#: -; MANF: -; ASSEMBLY: ASSEMBLY; PRICE: -; PARAM2: -; VALUE: 10K/0603
U6 = CMP-2000-05232-1: 256 Mb PC133 SDR SDRAM, 16 Mb x 16, 3 to 3.6 V, 0 to 70 degC, 54-Pin TSOP (TG), Pb-Free; Manufacturer: Micron; Maximum Random Access Time: 6ns; Organisation: 16Mx16bit; Package Version: Rev.W, 05/2012; Minimum Operating Supply Voltage: 3V; Number of Bits per Word: 16bit; Address Bus Width: 15bit; Memory Size: 256MB; Maximum Operating Supply Voltage: 3.6V; Number of Words: 16M; Maximum Operating Temperature: +70degC; Manufacturer URL: https://www.micron.com/; Package URL: https://www.micron.com/~/media/documents/products/data-sheet/dram/256mb_sdr.pdf; Package Type: TSOP; Mounting Type: SurfaceMount; Package Reference: TG-54; Dimensions: 22.22x10.16x1.2mm; Pin Count: 54; Datasheet URL: https://www.micron.com/~/media/documents/products/data-sheet/dram/256mb_sdr.pdf; Height: 1.2mm; Length: 22.22mm; Data Bus Width: 16bit; Datasheet Version: Rev. W, 05/2015; Minimum Operating Temperature: 0degC; Package Description: 54-Pin Thin Small Outline Package, Body 10.2 x 22.3 mm, Pitch 0.8 mm; Width: 10.16mm
U7 = CMP-2000-05006-2: IC FLASH 32M SPI 104MHZ 8SOIC; Manufacturer: Winbond; Obsolete Part: true; Access Time: 7ns; Nominal Supply Current: 8-20mA; Memory Size: 32Mbits; Max Supply Voltage: 3.6V; Min Supply Voltage: 2.7V; Standoff Height: 0.05mm; Interface: SPI,Other; Package: SS; Memory Type: FLASH; Ipc Land Pattern Name: SOIC127P790X195-8; Temperature Range High: +85°C; Temperature: -40°C to +85°C; Octopart: https://octopart.com/w25q32fvssig-winbond-23896462; Manufacturer Part Number: W25Q32FVSSIG; Ambient Temperature Range Low: -40°C; Lead Free: Yes; Height: 2.16mm; Automotive: No; Device Class L2: Memory; Digikey Description: IC FLASH 32M SPI 104MHZ 8SOIC; RoHS: TRUE; Frequency: 104MHz; Ambient Temperature Range High: +85°C; ComponentLink2Description: Datasheet; Category: IC; Device Class L1: Integrated Circuits (ICs); Device Class L3: Flash; Temperature Range Low: -40°C; Footprint Url: http://www.winbond.com/resource-files/an0000009%20spiflash%20pcb%20layout%20guideline%20v2.0%2009252017.pdf?__locale=en; ComponentLink2URL: https://www.winbond.com/resource-files/w25q32fv%20revj%2006032016.pdf

## Sheet COVER PAGE.SchDoc
size A3; SheetNumber: 2; SheetTotal: 13
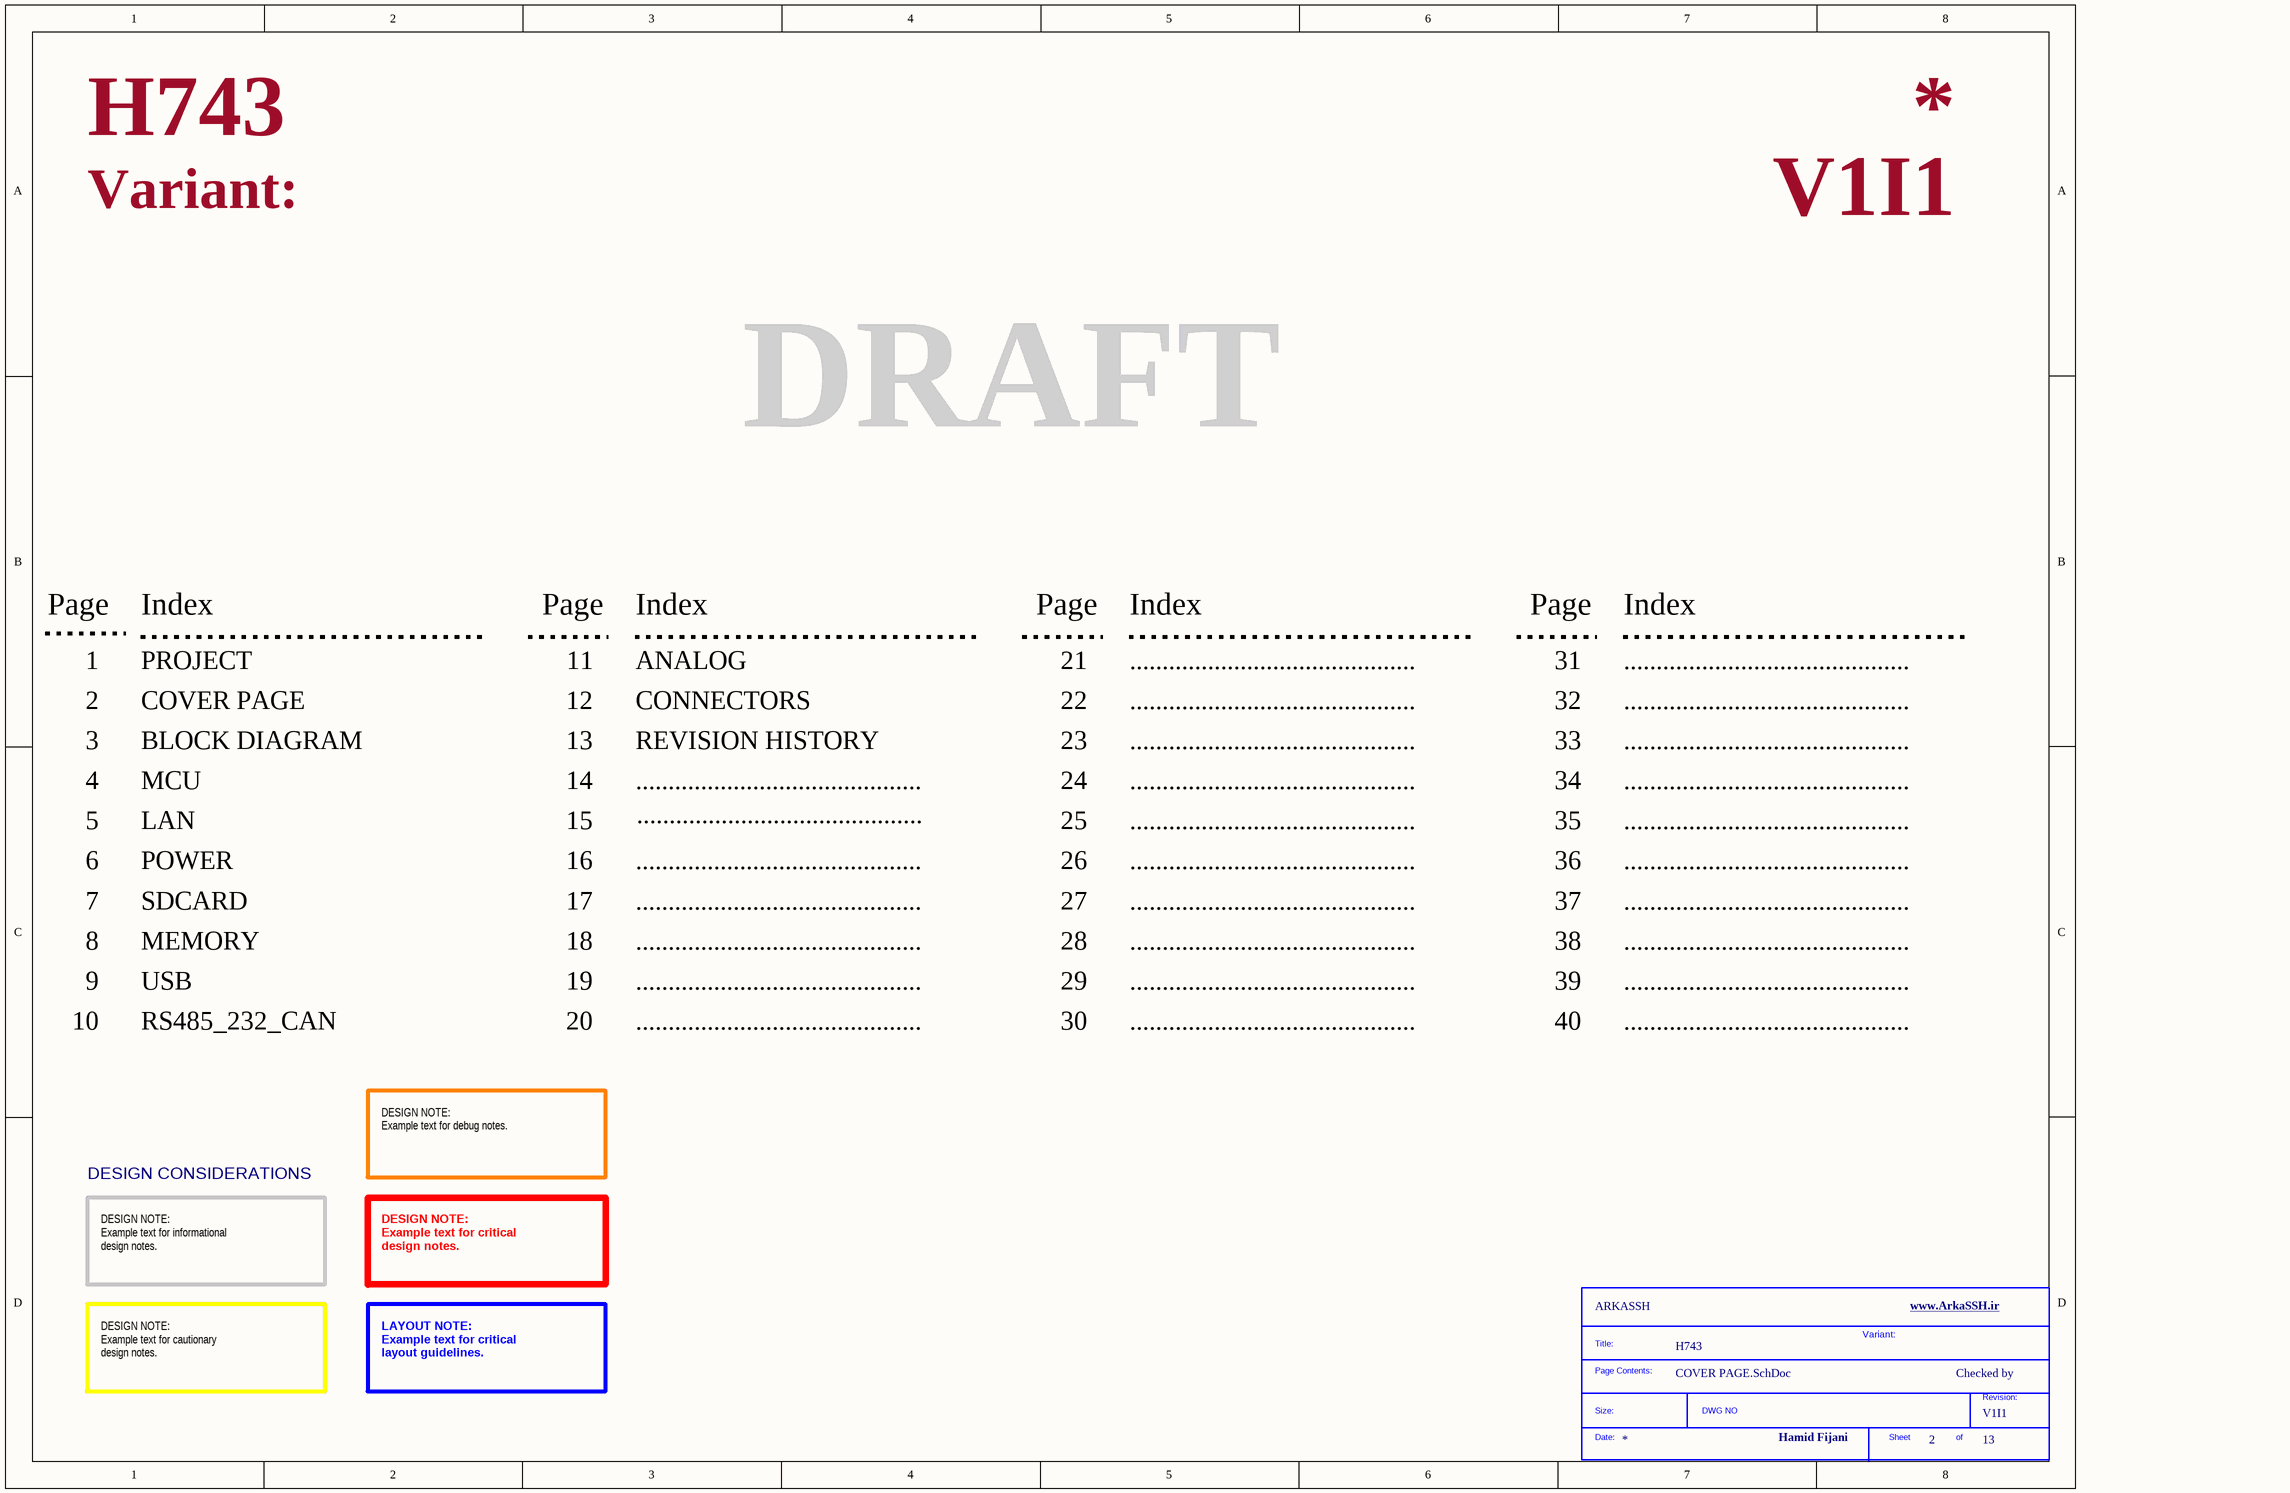
[diagram p6: COVER PAGE.SchDoc]

### Parts
(Parts that share a designator on the sheet are numbered #1, #2 ... from top to bottom, then left to right.)
*?#4  SDTitleBlock  (value not drawn)  (graphical)

### Notes on the sheet
- Variant:
- DRAFT
- Page
- Index
- 1
- 2
- PROJECT
- COVER PAGE
- 11
- 12
- ANALOG
- CONNECTORS
- 21
- 22
- ............................................
- 31
- 32
- 3
- BLOCK DIAGRAM
- 13
- REVISION HISTORY
- 23
- 33
- 4
- 5
- MCU
- LAN
- 14
- 15
- 24
- 25
- 34
- 35
- 6
- 7
- POWER
- SDCARD
- 16
- 17
- 26
- 27
- 36
- 37
- 8
- MEMORY
- 18
- 28
- 38
- 9
- 10
- USB
- RS485_232_CAN
- 19
- 20
- 29
- 30
- 39
- 40
- DESIGN CONSIDERATIONS
- DESIGN NOTE:
  Example text for debug notes.
- DESIGN NOTE:
  Example text for informational
  design notes.
- DESIGN NOTE:
  Example text for critical
  design notes.
- DESIGN NOTE:
  Example text for cautionary
  design notes.
- LAYOUT NOTE:
  Example text for critical
  layout guidelines.
- Checked by
- (in symbol SDTitleBlock) Title:; Page Contents:; Revision:; Size:; DWG NO; Date:; Sheet; of

## Sheet LAN.SchDoc
size A3; Author: HamidFijani; DrawnBy: HamidFijani; SheetNumber: 5; SheetTotal: 13
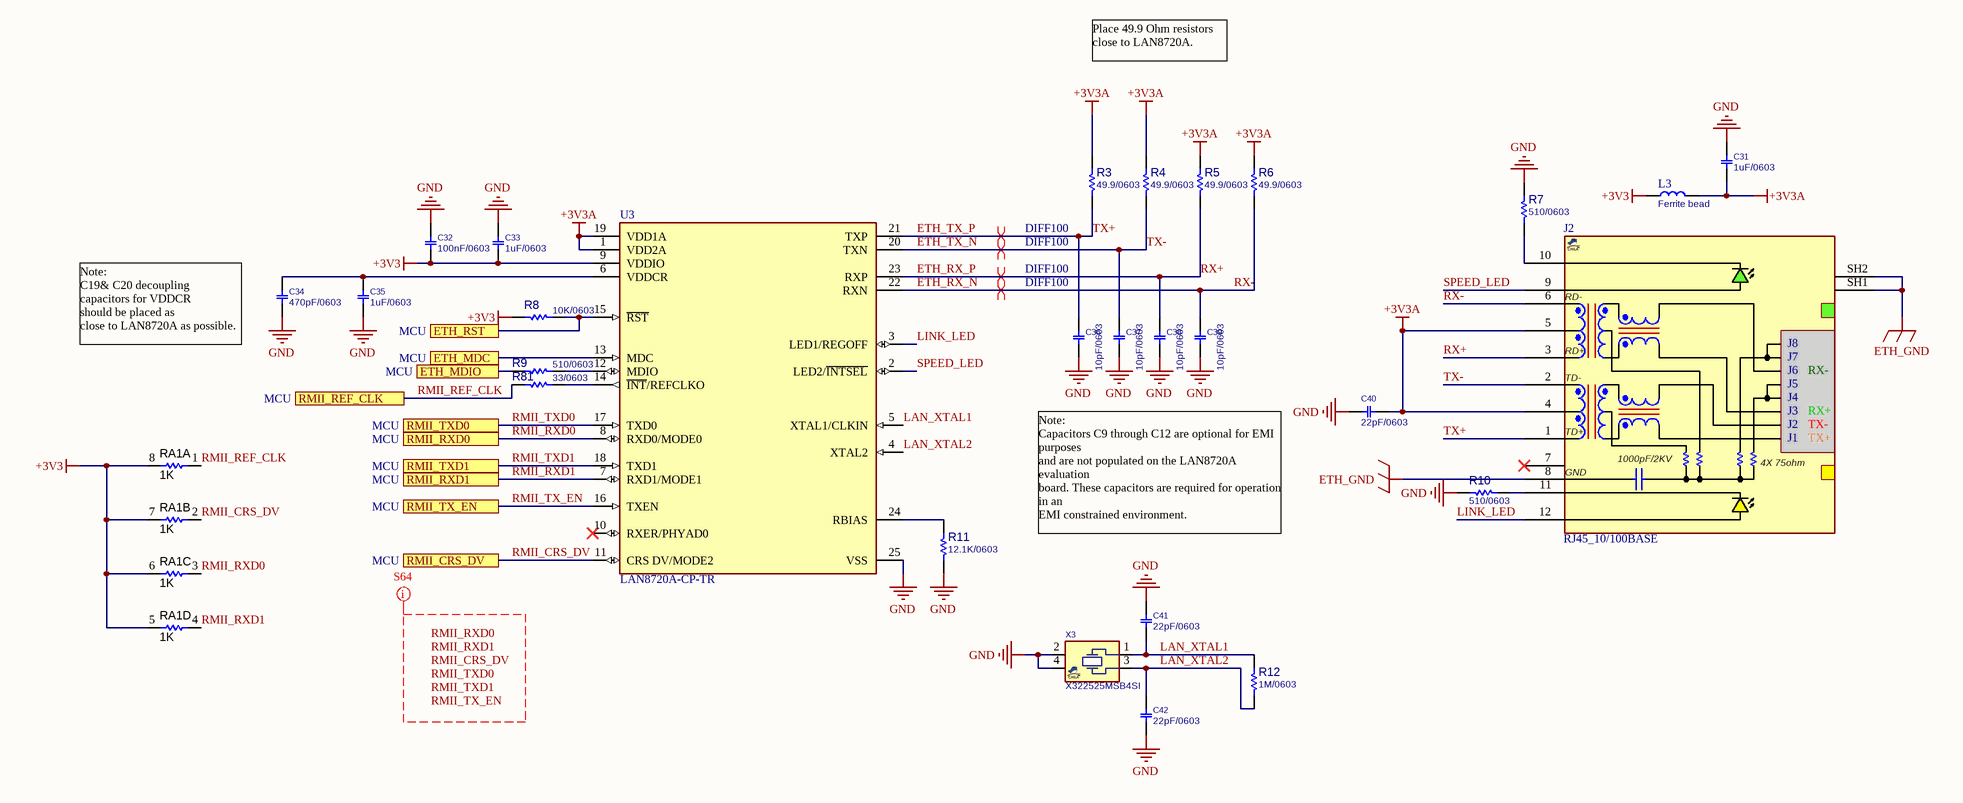
[diagram p7: LAN.SchDoc]

### Parts
(Parts that share a designator on the sheet are numbered #1, #2 ... from top to bottom, then left to right.)
?#3  (no value)  (graphical)
C31  1uF/0603  [C0603]
C32  100nF/0603  [C0603]
C33  1uF/0603  [C0603]
C34  470pF/0603  [C0603]
C35  1uF/0603  [C0603]
C36  10pF/0603  [C0603]
C37  10pF/0603  [C0603]
C38  10pF/0603  [C0603]
C39  10pF/0603  [C0603]
C40  22pF/0603  [C0603]
C41  22pF/0603  [C0603]
C42  22pF/0603  [C0603]
J2  RJ45_10/100BASE  [RJ45_8M_HR911105A]
L3  Ferrite bead  [L0805]
R3  49.9/0603  [R0603]
R4  49.9/0603  [R0603]
R5  49.9/0603  [R0603]
R6  49.9/0603  [R0603]
R7  510/0603  [R0603]
R8  10K/0603  [R0603]
R9  510/0603  [R0603]
R10  510/0603  [R0603]
R11  12.1K/0603  [R0603]
R12  1M/0603  [R0603]
R81  33/0603  [R0603]
RA1  value 1K  [RP0603X4]  (hidden comment: Film Res Pack)  (parts A,B,C,D of 4)
U3  LAN8720A-CP-TR  [FP-24-S4QFN-4x4B-0_5P-IPC_B]
X3  X322525MSB4SI  [XTL_4_3225]

### Ports
ETH_MDC (see MCU), ETH_MDIO (see MCU), ETH_RST (see MCU), RMII_CRS_DV (see MCU), RMII_REF_CLK (see MCU), RMII_RXD0 (see MCU), RMII_RXD1 (see MCU), RMII_TX_EN (see MCU), RMII_TXD0 (see MCU), RMII_TXD1 (see MCU)

### Nets
+3V3: C32.2 C33.2 L3.1 R8.1 RA1.5 RA1.6 RA1.7 RA1.8 U3.9(VDDIO)
+3V3A: C31.2 C40.1 J2.4(TCT) J2.5(RCT) L3.2 R3.2 R4.2 R5.2 R6.2 U3.1(VDD2A) U3.19(VDD1A)
ETH_GND: J2.8(CHSGND) J2.SH1 J2.SH2
GND: C31.1 C32.1 C33.1 C34.2 C35.2 C36.2 C37.2 C38.2 C39.2 C40.2 C41.2 C42.1 R7.2 R10.1 R11.1 U3.25(VSS) X3.2 X3.4
ETH_RX_N: C39.1 J2.6(RD-) R6.1 U3.22(RXN)  [also labelled RX-]
ETH_RX_P: C38.1 J2.3(RD+) R5.1 U3.23(RXP)  [also labelled RX+]
ETH_TX_N: C37.1 J2.2(TD-) R4.1 U3.20(TXN)  [also labelled TX-]
ETH_TX_P: C36.1 J2.1(TD+) R3.1 U3.21(TXP)  [also labelled TX+]
LAN_XTAL1: C41.1 R12.2 U3.5(XTAL1/CLKIN) X3.1
LAN_XTAL2: C42.2 R12.1 U3.4(XTAL2) X3.3
LINK_LED: J2.12(YLED+) U3.3(LED1/REGOFF)
RMII_CRS_DV: RA1.2 U3.11(CRS_DV/MODE2) ; port RMII_CRS_DV
RMII_REF_CLK: R81.1 RA1.1 ; port RMII_REF_CLK
RMII_RXD0: RA1.3 U3.8(RXD0/MODE0) ; port RMII_RXD0
RMII_RXD1: RA1.4 U3.7(RXD1/MODE1) ; port RMII_RXD1
RMII_TX_EN: U3.16(TXEN) ; port RMII_TX_EN
RMII_TXD0: U3.17(TXD0) ; port RMII_TXD0
RMII_TXD1: U3.18(TXD1) ; port RMII_TXD1
SPEED_LED: J2.9(GLED+) U3.2(LED2/~{INTSEL})
NetC34_1: C34.1 C35.1 U3.6(VDDCR)
NetJ2_10: J2.10(GLED-) R7.1
NetJ2_11: J2.11(YLED-) R10.2
NetR8_2: R8.2 U3.15(~{RST}) ; port ETH_RST
NetR9_1: R9.1 ; port ETH_MDIO
NetR9_2: R9.2 U3.12(MDIO)
NetR11_2: R11.2 U3.24(RBIAS)
NetR81_2: R81.2 U3.14(~{INT}/REFCLKO)
NetU1_33: U3.13(MDC) ; port ETH_MDC

Not connected (* = marked no-connect by the designer): J2 7(NC)*; U3 10(RXER/PHYAD0)*

### Layout directives
differential pair; differential pair class DIFF100: ETH_RX_N, ETH_RX_P, ETH_TX_N, ETH_TX_P
net class S64: RMII_CRS_DV, RMII_RXD0, RMII_RXD1, RMII_TX_EN, RMII_TXD0, RMII_TXD1

### Notes on the sheet
- Place 49.9 Ohm resistors
  close to LAN8720A.
- (near C34) Note:
  C19& C20 decoupling
  capacitors for VDDCR
  should be placed as
  close to LAN8720A as possible.
- Note:
  Capacitors C9 through C12 are optional for EMI purposes
  and are not populated on the LAN8720A evaluation
  board. These capacitors are required for operation in an
  EMI constrained environment.
- Labels drawn without touching a wire or pin: RMII_CRS_DV, RMII_RXD0, RMII_RXD1, RMII_TX_EN, RMII_TXD0, RMII_TXD1
- Title:
- Page Contents:
- Variant:
- Checked by
- Size:
- Date:
- DWG NO
- Sheet
- of
- Revision:
- (in symbol RJ45_HR911105A) J8; J7; J6; RX-; J5; J4; J3; RX+; TX-; J1; TX+; 1000pF/2KV; 4X 75ohm; GND

### Library data of the parts
?#3 = SDTitleBlock
C31-C42 = CAP_SMD_MLCC_0603: as C1 on sheet MCU; PRICE: 100= 1$; MANF: -; ASSEMBLY: ASSEMBLY
  C31 C33 C35: VALUE: 1uF/0603
  C32: VALUE: 100nF/0603
  C34: VALUE: 470pF/0603
  C36-C39: VALUE: 10pF/0603
  C40-C42: VALUE: 22pF/0603
J2 = RJ45_HR911105A: RJ45, 10/100BASE, G/Y LED; MANF: Hanrun; MANF_P#: HR911105A; PARAM2: 10/100BASE, G/Y LED; VALUE: RJ45_10/100BASE
L3 = IND_SMD: INDUCTOR, SMD; VALUE: Ferrite bead
R3-R12 R81 = RES_SMD_0603: as R1 on sheet MCU; MANF_P#: -; MANF: -; ASSEMBLY: ASSEMBLY; PRICE: -; PARAM2: -
  R3-R6: VALUE: 49.9/0603
  R7 R9 R10: VALUE: 510/0603
  R8: VALUE: 10K/0603
  R11: VALUE: 12.1K/0603
  R12: VALUE: 1M/0603
  R81: VALUE: 33/0603
RA1 = RES_SMD_PACK_X4: RESISTOR, SMD, PACKX4; MANF_P#: MANF_PART#; MANF: MANF
U3 = CMP-06281-000046-1: IC TRANSCEIVER FULL 2/2 24SQFN; Simplex/Duplex: Full Duplex; Min Supply Voltage: 1.14V; Data Rate: 100Mbps; Max Supply Current: 21mA; Operating Supply Voltage: 1.2V; Number of Transceivers: 1; Max Supply Voltage: 1.26V; Mount: Surface Mount; Packaging: Tape and Reel; Max Operating Temperature: 85°C; RoHS Compliant: Yes; Min Operating Temperature: -40°C; Number of Pins: 24; Weight: 0.032741oz; Package Quantity: 5000; Case/Package: QFN
X3 = XTL_4_24MHz_3225A: as X1 on sheet MCU; PRICE: 0.7$; VALUE: X322525MSB4SI

## Sheet SDCARD.SchDoc
size A3; Author: HamidFijani; DrawnBy: HamidFijani; SheetNumber: 7; SheetTotal: 13
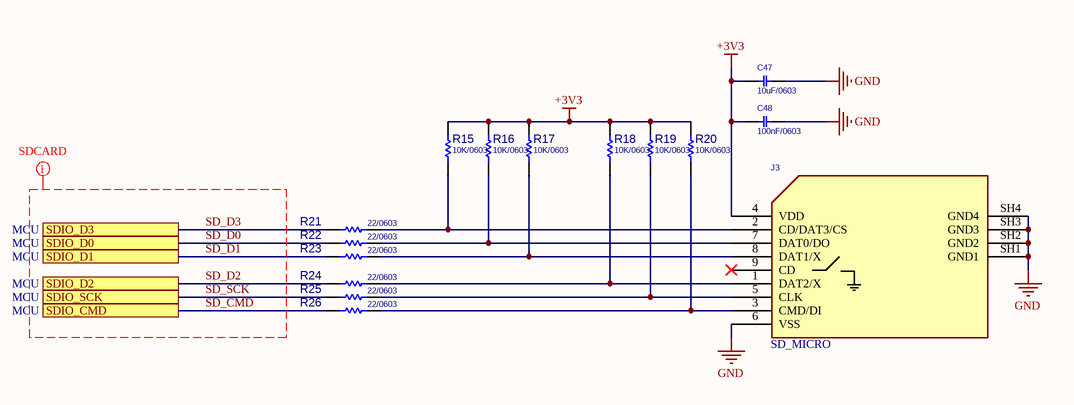
[diagram p8: SDCARD.SchDoc]

### Parts
(Parts that share a designator on the sheet are numbered #1, #2 ... from top to bottom, then left to right.)
?#4  (no value)  (graphical)
C47  10uF/0603  [C0603]
C48  100nF/0603  [C0603]
J3  SD_MICRO  [SDMICRO_AT]
R15  10K/0603  [R0603]
R16  10K/0603  [R0603]
R17  10K/0603  [R0603]
R18  10K/0603  [R0603]
R19  10K/0603  [R0603]
R20  10K/0603  [R0603]
R21  22/0603  [R0603]
R22  22/0603  [R0603]
R23  22/0603  [R0603]
R24  22/0603  [R0603]
R25  22/0603  [R0603]
R26  22/0603  [R0603]

### Ports
SDIO_CMD (see MCU), SDIO_D0 (see MCU), SDIO_D1 (see MCU), SDIO_D2 (see MCU), SDIO_D3 (see MCU), SDIO_SCK (see MCU)

### Nets
+3V3: C47.1 C48.1 J3.4(VDD) R15.1 R16.1 R17.1 R18.1 R19.1 R20.1
GND: C47.2 C48.2 J3.6(VSS) J3.SH1(GND1) J3.SH2(GND2) J3.SH3(GND3) J3.SH4(GND4)
SD_CMD: R26.1 ; port SDIO_CMD
SD_D0: R22.1 ; port SDIO_D0
SD_D1: R23.1 ; port SDIO_D1
SD_D2: R24.1 ; port SDIO_D2
SD_D3: R21.1 ; port SDIO_D3
SD_SCK: R25.1 ; port SDIO_SCK
NetJ3_1: J3.1(DAT2/X) R18.2 R24.2
NetJ3_2: J3.2(CD/DAT3/CS) R15.2 R21.2
NetJ3_3: J3.3(CMD/DI) R20.2 R26.2
NetJ3_5: J3.5(CLK) R19.2 R25.2
NetJ3_7: J3.7(DAT0/DO) R16.2 R22.2
NetJ3_8: J3.8(DAT1/X) R17.2 R23.2

Not connected (* = marked no-connect by the designer): J3 9(CD)*

### Layout directives
net class SDCARD: SD_CMD, SD_D0, SD_D1, SD_D2, SD_D3, SD_SCK

### Notes on the sheet
- Title:
- Page Contents:
- Variant:
- Checked by
- Size:
- Date:
- DWG NO
- Sheet
- of
- Revision:

### Library data of the parts
?#4 = SDTitleBlock
C47 C48 = CAP_SMD_MLCC_0603: CAP, MLCC, -F, -V, MATERIAL, -%, 0201; PARAM: -, -%; MANF_P#: MANF_PART#; PRICE: 100= 1$; MANF: -; PARAM2: -V; ASSEMBLY: ASSEMBLY
  C47: VALUE: 10uF/0603
  C48: VALUE: 100nF/0603
J3 = SOCKET_SDMICRO_AT: SD MICRO exist in Iran, Attend 112J-TDAR-R01; PARAM: push-push; MANF: Attend; MANF_P#: 112J-TDAR-R01; VALUE: SD_MICRO
R15-R26 = RES_SMD_0603: RESISTOR, SMD; PARAM: -W; DESC: DESCRIPTION; DIST#: MOUSER; PARAM2: 1%; MANF_P#: -; MANF: -; ASSEMBLY: ASSEMBLY; PRICE: 100= 0.5$
  R15-R20: VALUE: 10K/0603
  R21-R26: VALUE: 22/0603

## Sheet USB.SchDoc
size A3; Author: HamidFijani; DrawnBy: HamidFijani; SheetNumber: 9; SheetTotal: 13
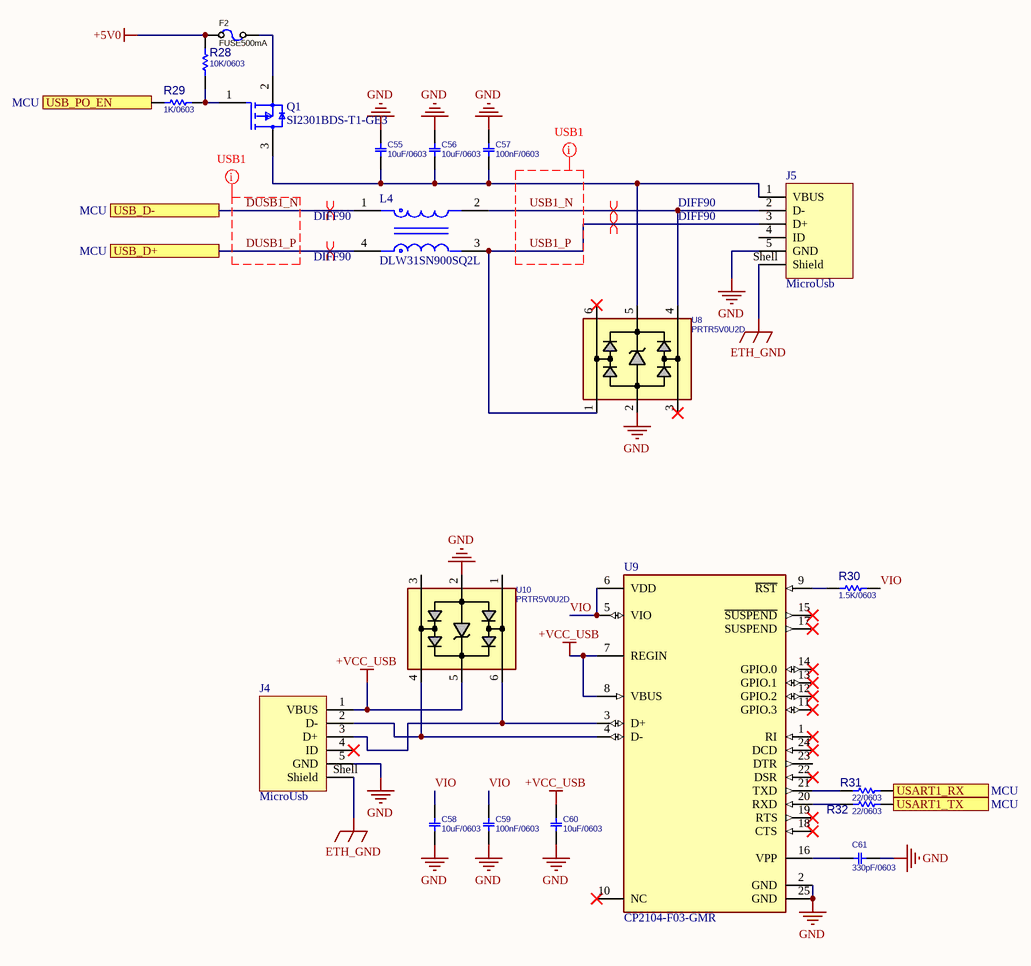
[diagram p9: USB.SchDoc]

### Parts
(Parts that share a designator on the sheet are numbered #1, #2 ... from top to bottom, then left to right.)
?#5  (no value)  (graphical)
C55  10uF/0603  [C0603]
C56  10uF/0603  [C0603]
C57  100nF/0603  [C0603]
C58  10uF/0603  [C0603]
C59  100nF/0603  [C0603]
C60  10uF/0603  [C0603]
C61  330pF/0603  [C0603]
F2  FUSE500mA  [F1206]
J4  MicroUsb  [MicroUsb]
J5  MicroUsb  [MicroUsb]
L4  DLW31SN900SQ2L  [FP-DLW31S-MFG]
Q1  SI2301BDS-T1-GE3  [FP-S-03946-MFG]
R28  10K/0603  [R0603]
R29  1K/0603  [R0603]
R30  1.5K/0603  [R0603]
R31  22/0603  [R0603]
R32  22/0603  [R0603]
U8  PRTR5V0U2D  [SOT23_6]
U9  CP2104-F03-GMR  [FP-CP2104-F03-GMR-IPC_C]
U10  PRTR5V0U2D  [SOT23_6]

### Ports
USART1_RX (see MCU), USART1_TX (see MCU), USB_D+ (see MCU), USB_D- (see MCU), USB_PO_EN (see MCU)

### Nets
+5V0: F2.1 R28.1
+VCC_USB: C60.2 J4.1(VBUS) U9.7(REGIN) U9.8(VBUS) U10.5
ETH_GND: J4.Shell(Shield) J5.Shell(Shield)
GND: C55.1 C56.1 C57.1 C58.1 C59.1 C60.1 C61.1 J4.5(GND) J5.5(GND) U8.2 U9.2(GND) U9.25(GND) U10.2
DUSB1_N: L4.1 ; port USB_D-
DUSB1_P: L4.4 ; port USB_D+
USB1_N: J5.2(D-) L4.2 U8.4
USB1_P: J5.3(D+) L4.3 U8.1
VIO: C58.2 C59.2 R30.2 U9.5(VIO) U9.6(VDD)
NetC55_2: C55.2 C56.2 C57.2 J5.1(VBUS) Q1.3(D) U8.5
NetC61_2: C61.2 U9.16(VPP)
NetF2_2: F2.2 Q1.2(S)
NetJ4_2: J4.2(D-) U9.4(D-) U10.4
NetJ4_3: J4.3(D+) U9.3(D+) U10.6
NetQ1_1: Q1.1(G) R28.2 R29.2
NetR29_1: R29.1 ; port USB_PO_EN
NetR30_1: R30.1 U9.9(~{RST})
NetR31_1: R31.1 U9.21(TXD)
NetR31_2: R31.2 ; port USART1_RX
NetR32_1: R32.1 U9.20(RXD)
NetR32_2: R32.2 ; port USART1_TX

Not connected (* = marked no-connect by the designer): J4 4(ID)*; J5 4(ID); U8 3* 6*; U9 1(RI)* 10(NC)* 11(GPIO.3)* 12(GPIO.2)* 13(GPIO.1)* 14(GPIO.0)* 15(~{SUSPEND})* 17(SUSPEND)* 18(CTS)* 19(RTS)* 22(DSR)* 23(DTR) 24(DCD)*; U10 1 3

### Layout directives
differential pair; differential pair class DIFF90: DUSB1_N, DUSB1_P, USB1_N, USB1_P
net class USB1: DUSB1_N, DUSB1_P, USB1_N, USB1_P

### Notes on the sheet
- Title:
- Page Contents:
- Variant:
- Checked by
- Size:
- Date:
- DWG NO
- Sheet
- of
- Revision:

### Library data of the parts
?#5 = SDTitleBlock
C55-C61 = CAP_SMD_MLCC_0402: CAP, MLCC, -F, -V, MATERIAL, -%, 0201; PARAM: -, -%; MANF_P#: MANF_PART#; PRICE: 100= 1$; MANF: -; PARAM2: -V; ASSEMBLY: ASSEMBLY
  C55 C56 C58 C60: VALUE: 10uF/0603
  C57 C59: VALUE: 100nF/0603
  C61: VALUE: 330pF/0603
F2 = FUSE_160mA_1206: as F1 on sheet POWER; PARAM2: PARAM2; VALUE: FUSE500mA
L4 = CMP-06045-000166-1: as L1 on sheet MCU; Weight: 0.001376oz; Case/Package: 1206; Width: 0.063inch; Case Code (Imperial): 1206; Max Operating Temperature: 85°C; Lead Free: Lead Free; Max DC Current: 370mA; DC Current: 370mA; Military Standard: Not; Package Quantity: 1; Radiation Hardening: No; Packaging: Tape and Reel; Depth: 1.6mm; Height: 1.9mm; Termination: SMD/SMT; Current: 370mA; Length: 3.2mm; Current Rating: 370mA; Resistor Type: Wirewound; Mount: Surface Mount; Min Operating Temperature: -40°C; Test Frequency: 100MHz
Q1 = CMP-00030-42864886-1: SI2301BDS-T1-GE3 Trans Mosfet P-ch Si 20V 2.2A 3-PIN SOT-23 T/r / Mosfet P-ch 20V 2.2A SOT23-3; Rise Time: 40ns; Nominal Vgs: -950mV; Gate to Source Voltage (Vgs): 8V; Element Configuration: Single; Number of Channels: 1; Power Dissipation: 700mW; Resistance: 100MΩ; Continuous Drain Current (ID): -2.2A; Drain to Source Breakdown Voltage: -20V; Turn-On Delay Time: 20ns; Turn-Off Delay Time: 30ns; Input Capacitance: 375pF; Schedule B: 8541210080, 8541210080; Length: 3.04mm; Height: 1.02mm; Radiation Hardening: No; RoHS: Compliant; NexarPartId: 42864886; Number of Pins: 3; Weight: 1.437803g; Mount: Surface Mount; Min Operating Temperature: -55°C; Number of Elements: 1; Drain to Source Resistance: 100mΩ; Max Power Dissipation: 700mW; Threshold Voltage: -950mV; Lead Free: Lead Free; Rds On Max: 100mΩ; Width: 1.4mm; REACH SVHC: Unknown; Fall Time: 40ns; Max Operating Temperature: 150°C; Drain to Source Voltage (Vdss): -20V; Case/Package: SOT-23-3
R28-R32 = RES_SMD_0603: as R15 on sheet SDCARD; MANF_P#: -; MANF: -; ASSEMBLY: ASSEMBLY; PRICE: 100= 0.5$
  R28: VALUE: 10K/0603
  R29: VALUE: 1K/0603
  R30: VALUE: 1.5K/0603
  R31 R32: VALUE: 22/0603
U8 U10 = TVS_X3_PRTR5V0U2D: TVS, ESD PROTECT, 3CH; MANF: NXP; MANF_P#: PRTR5V0U2D; VALUE: PRTR5V0U2D
U9 = CMP-08107-000004-1: IC SGL USB-TO-UART BRIDGE 24QFN; Manufacturer: Silicon Laboratories; Max Supply Voltage: 3.6V; Min Supply Voltage: 1.8V; Nominal Supply Current: 100-17000uA; Standoff Height: 0mm; Interface: UART,USB; Temperature Range Low: -40°C; Lead Free: Yes; Device Class L3: Controllers; Ambient Temperature Range Low: -55°C; Automotive: No; Category: IC; Temperature: -40°C to +85°C; Octopart: https://octopart.com/cp2104-f03-gmr-silicon+labs-19668642; Ambient Temperature Range High: +125°C; Package: CP2104-F03-GMR; Device Class L2: Interface ICs; Digikey Description: IC SGL USB-TO-UART BRIDGE 24QFN; Device Class L1: Integrated Circuits (ICs); Manufacturer Part Number: CP2104-F03-GMR; Temperature Range High: +85°C; ComponentLink2URL: https://www.silabs.com/documents/public/data-sheets/cp2104.pdf; Height: 0.8mm; Ipc Land Pattern Name: QFN50P400X400X75-24; Mouser Description: I/O Controller Interface IC USB to UART bridge; ComponentLink2Description: Datasheet; RoHS: TRUE

## Sheet RS485_232_CAN.SchDoc
size A3; Author: HamidFijani; DrawnBy: HamidFijani; SheetNumber: 10; SheetTotal: 13
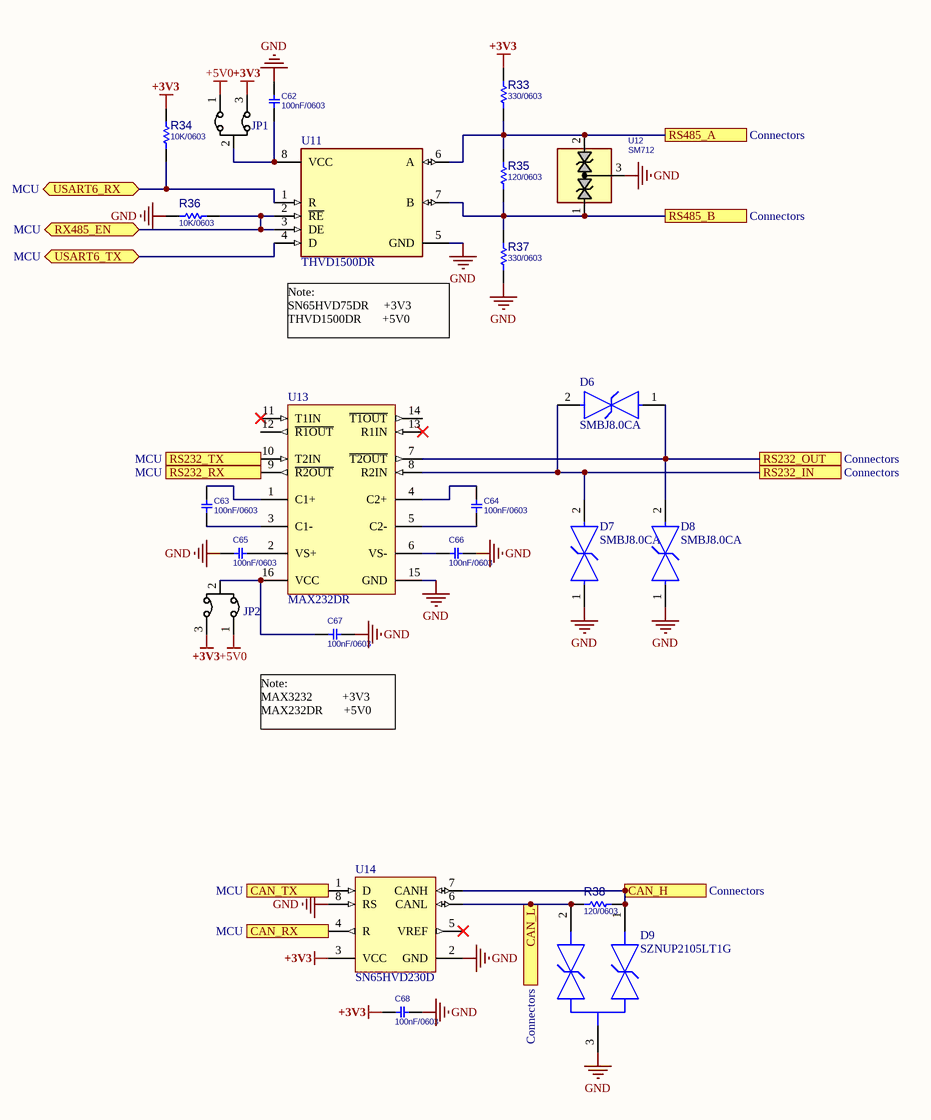
[diagram p10: RS485_232_CAN.SchDoc]

### Parts
(Parts that share a designator on the sheet are numbered #1, #2 ... from top to bottom, then left to right.)
?#6  (no value)  (graphical)
C62  100nF/0603  [C0603]
C63  100nF/0603  [C0603]
C64  100nF/0603  [C0603]
C65  100nF/0603  [C0603]
C66  100nF/0603  [C0603]
C67  100nF/0603  [C0603]
C68  100nF/0603  [C0603]
D6  SMBJ8.0CA  [FP-DO-214AA-CA-MFG]
D7  SMBJ8.0CA  [FP-DO-214AA-CA-MFG]
D8  SMBJ8.0CA  [FP-DO-214AA-CA-MFG]
D9  SZNUP2105LT1G  [FP-318-08-MFG]
JP1  JMPHDR3PIN  [JP_3_40X90]  (value not drawn)  (no BOM)
JP2  JMPHDR3PIN  [JP_3_40X90]  (value not drawn)  (no BOM)
R33  330/0603  [R0603]
R34  10K/0603  [R0603]
R35  120/0603  [R0603]
R36  10K/0603  [R0603]
R37  330/0603  [R0603]
R38  120/0603  [R0603]
U11  THVD1500DR  [FP-D0008A-MFG]
U12  SM712  [SOT23_3]
U13  MAX232DR  [D0016A_N]
U14  SN65HVD230D  [D0008A_M]

### Ports
CAN_H (see Connectors), CAN_L (see Connectors), CAN_RX (see MCU), CAN_TX (see MCU), RS232_IN (see Connectors), RS232_OUT (see Connectors), RS232_RX (see MCU), RS232_TX (see MCU), RS485_A (see Connectors), RS485_B (see Connectors), RX485_EN (bidir, see MCU), USART6_RX (bidir, see MCU), USART6_TX (bidir, see MCU)

### Nets
+3V3: C68.1 JP1.3 JP2.3 R33.1 R34.1 U14.3(VCC)
+5V0: JP1.1 JP2.1
GND: C62.2 C65.2 C66.1 C67.2 C68.2 D7.1 D8.1 D9.3 R36.1 R37.2 U11.5(GND) U12.3(NC) U13.15(GND) U14.2(GND) U14.8(RS)
NetC62_1: C62.1 JP1.2 U11.8(VCC)
NetC63_1: C63.1 U13.3(C1-)
NetC63_2: C63.2 U13.1(C1+)
NetC64_1: C64.1 U13.5(C2-)
NetC64_2: C64.2 U13.4(C2+)
NetC65_1: C65.1 U13.2(VS+)
NetC66_2: C66.2 U13.6(VS-)
NetC67_1: C67.1 JP2.2 U13.16(VCC)
NetD6_1: D6.1 D8.2 U13.7(~{T2OUT}) ; port RS232_OUT
NetD6_2: D6.2 D7.2 U13.8(R2IN) ; port RS232_IN
NetD9_1: D9.1 R38.2 U14.7(CANH) ; port CAN_H
NetD9_2: D9.2 R38.1 U14.6(CANL) ; port CAN_L
NetP2_1: R33.2 R35.1 U11.6(A) U12.2(GND) ; port RS485_A
NetP2_6: R35.2 R37.1 U11.7(B) U12.1(NC) ; port RS485_B
NetR34_2: R34.2 U11.1(R) ; port USART6_RX
NetR36_2: R36.2 U11.2(~{RE}) U11.3(DE) ; port RX485_EN
NetU1_92: U14.4(R) ; port CAN_RX
NetU1_93: U14.1(D) ; port CAN_TX
NetU1_115: U11.4(D) ; port USART6_TX
NetU1_128: U13.10(T2IN) ; port RS232_TX
NetU1_129: U13.9(~{R2OUT}) ; port RS232_RX

Not connected (* = marked no-connect by the designer): U13 11(T1IN)* 12(~{R1OUT}) 13(R1IN)* 14(~{T1OUT}); U14 5(VREF)*

### Notes on the sheet
- Note:
  SN65HVD75DR     +3V3
  THVD1500DR       +5V0
- Note:
  MAX3232          +3V3
  MAX232DR       +5V0
- Title:
- Page Contents:
- Variant:
- Checked by
- Size:
- Date:
- DWG NO
- Sheet
- of
- Revision:

### Library data of the parts
?#6 = SDTitleBlock
C62-C68 = CAP_SMD_MLCC_0402: as C55 on sheet USB; PRICE: 100= 1$; MANF: -; PARAM2: -V; ASSEMBLY: ASSEMBLY; VALUE: 100nF/0603
D6-D8 = CMP-06396-000048-1: TVS DIODE 90VWM 146VC SMBJ
D9 = CMP-1063-00167-2: TVS DIODE 24V 44V SOT23-3; Manufacturer: ON Semiconductor; Capacitance: 30pF; Max Junction Temp: +150°C; Breakdown Voltage: 26.2V; Number Of Channels: 2; Automotive Grade: Grade 0; Standoff Height: 0.01mm; Peak Pulse Current: 8A; Value: 30pF; Direction: Bidirectional; Peak Pulse Power: 350W; Octopart: https://octopart.com/sznup2105lt1g-on+semiconductor-22134626; Reverse Standoff Voltage: 24V; Digikey Description: TVS DIODE 24V 44V SOT23-3; RoHS: TRUE; Manufacturer Part Number: SZNUP2105LT1G; Height: 1.11mm; Automotive: Yes; ComponentLink2URL: https://www.onsemi.com/pub/Collateral/NUP2105L-D.PDF; Device Class L3: unset; Package: 318-08; Lead Free: Yes; Device Class L2: TVS Diodes; Footprint Url: https://www.onsemi.com/pub/Collateral/318-08.PDF; Temperature Range Low: -55°C; Device Class L1: Circuit Protection; Temperature: -55°C to +150°C; Temperature Range High: +150°C; Category: Diode; Clamping Voltage: 44V; ComponentLink2Description: Datasheet
JP1 JP2 = JUMPER_SOLDER_3P: JUMPER, HEADER 3PIN; MANF: MANF; MANF_P#: MANF_P#; VALUE: JMPHDR3PIN
R33-R38 = RES_SMD_0603: as R15 on sheet SDCARD; MANF_P#: -; MANF: -; ASSEMBLY: ASSEMBLY; PRICE: 100= 0.5$
  R33 R37: VALUE: 330/0603
  R34 R36: VALUE: 10K/0603
  R35 R38: VALUE: 120/0603
U11 = CMP-0694-00003-3: IC TRANSCEIVER HALF 1/1 8SOIC; Max Supply Voltage: 3.6V; Number of Receivers: 1; Data Rate: 20Mbps; Operating Supply Voltage: 3.3V; Simplex/Duplex: Half Duplex; Receiver Hysteresis: 80mV; Interface: RS-422; Supply Current: 950uA; Min Supply Voltage: 3V; Lead Free: Lead Free; Max Operating Temperature: 125°C; Min Operating Temperature: -40°C; Packaging: Tape and Reel; REACH SVHC: No SVHC; Number of Transmitters: 1; Logic Function: Transceiver; Radiation Hardening: No; RoHS Compliant: Yes; Number of Drivers: 1; Contact Plating: Gold; Series: -; Number of Transceivers: 1; Case/Package: D; Package Quantity: 2500; Number of Pins: 8; Nominal Supply Current: 950uA
U12 = TVS_X2_CDSOT23-SM712: TVS, ESD PROTECT, 2CH, 400W/17A PP, 7.5VBR, ±8KV ESDmin; MANF: Bourns; PARAM: 400W/17A peak-pulse; MANF_P#: SM712; PARAM2: 7.5VBR, ±8KV ESD min; PRICE: 1.6$; VALUE: SM712
U13 = CMP-0299-00150-2: Dual EIA-232 Driver / Receiver, 0 to 70 degC, 16-Pin SOIC (D), Green (RoHS & no Sb/Br); Single Supply: TRUE; Supply Voltage(s)(V): 5; SubFamily: RS-232; Drivers Per Package: 2; ICC(Max)(mA): 10; ESD HBM(kV): +/-2; ComponentLink1Description: Manufacturer URL; ComponentLink2Description: Datasheet; RS-232: TRUE; ComponentLink3URL: http://www.ti.com/litv/pdf/mpds178g; DatasheetVersion: SLLS047L; ComponentLink1URL: www.ti.com; PackageDescription: 16-Pin Plastic Small Outline Integrated Circuit, 9.9 x 3.9 mm, Pitch 1.27 mm Pitch; PackageVersion: revM, Jun-2011; ComponentLink2URL: http://www.ti.com/general/docs/lit/getliterature.tsp?genericPartNumber=MAX232&fileType=pdf; ComponentLink3Description: Package Specification; PackageReference: D0016A; Receivers Per Package: 2
U14 = CMP-0315-00046-3: CAN Bus Transceiver, 3.3 V, -40 to 85 degC, 8-Pin SOIC (D), Green (RoHS & no Sb/Br), Tube; Supply Voltage Min: 3 V; Supply Voltage Max: 3.6 V; PartNumber: SN65HVD230D; ComponentLink2URL: http://www.ti.com/general/docs/lit/getliterature.tsp?genericGeneric Part Number=SN65HVD230&fileType=pdf; DatasheetVersion: SLOS346N; Generic Part Number: SN65HVD230; Packing: Tube; Temperature Min: -40 degC; Temperature Max: 85 degC; ComponentLink1Description: Manufacturer URL; Mounting Technology: Surface Mount; RoHS: TRUE; ComponentLink1URL: http://www.ti.com/; ComponentLink2Description: Datasheet; PackageDescription: 8-Pin Plastic Small Outline, Body 4.9 x 3.9 mm, Pitch 1.27 mm